# EAGLE design PX4FMUlite_V0_1 (EAGLE 6.5.0)

## Sheet 1 of 12
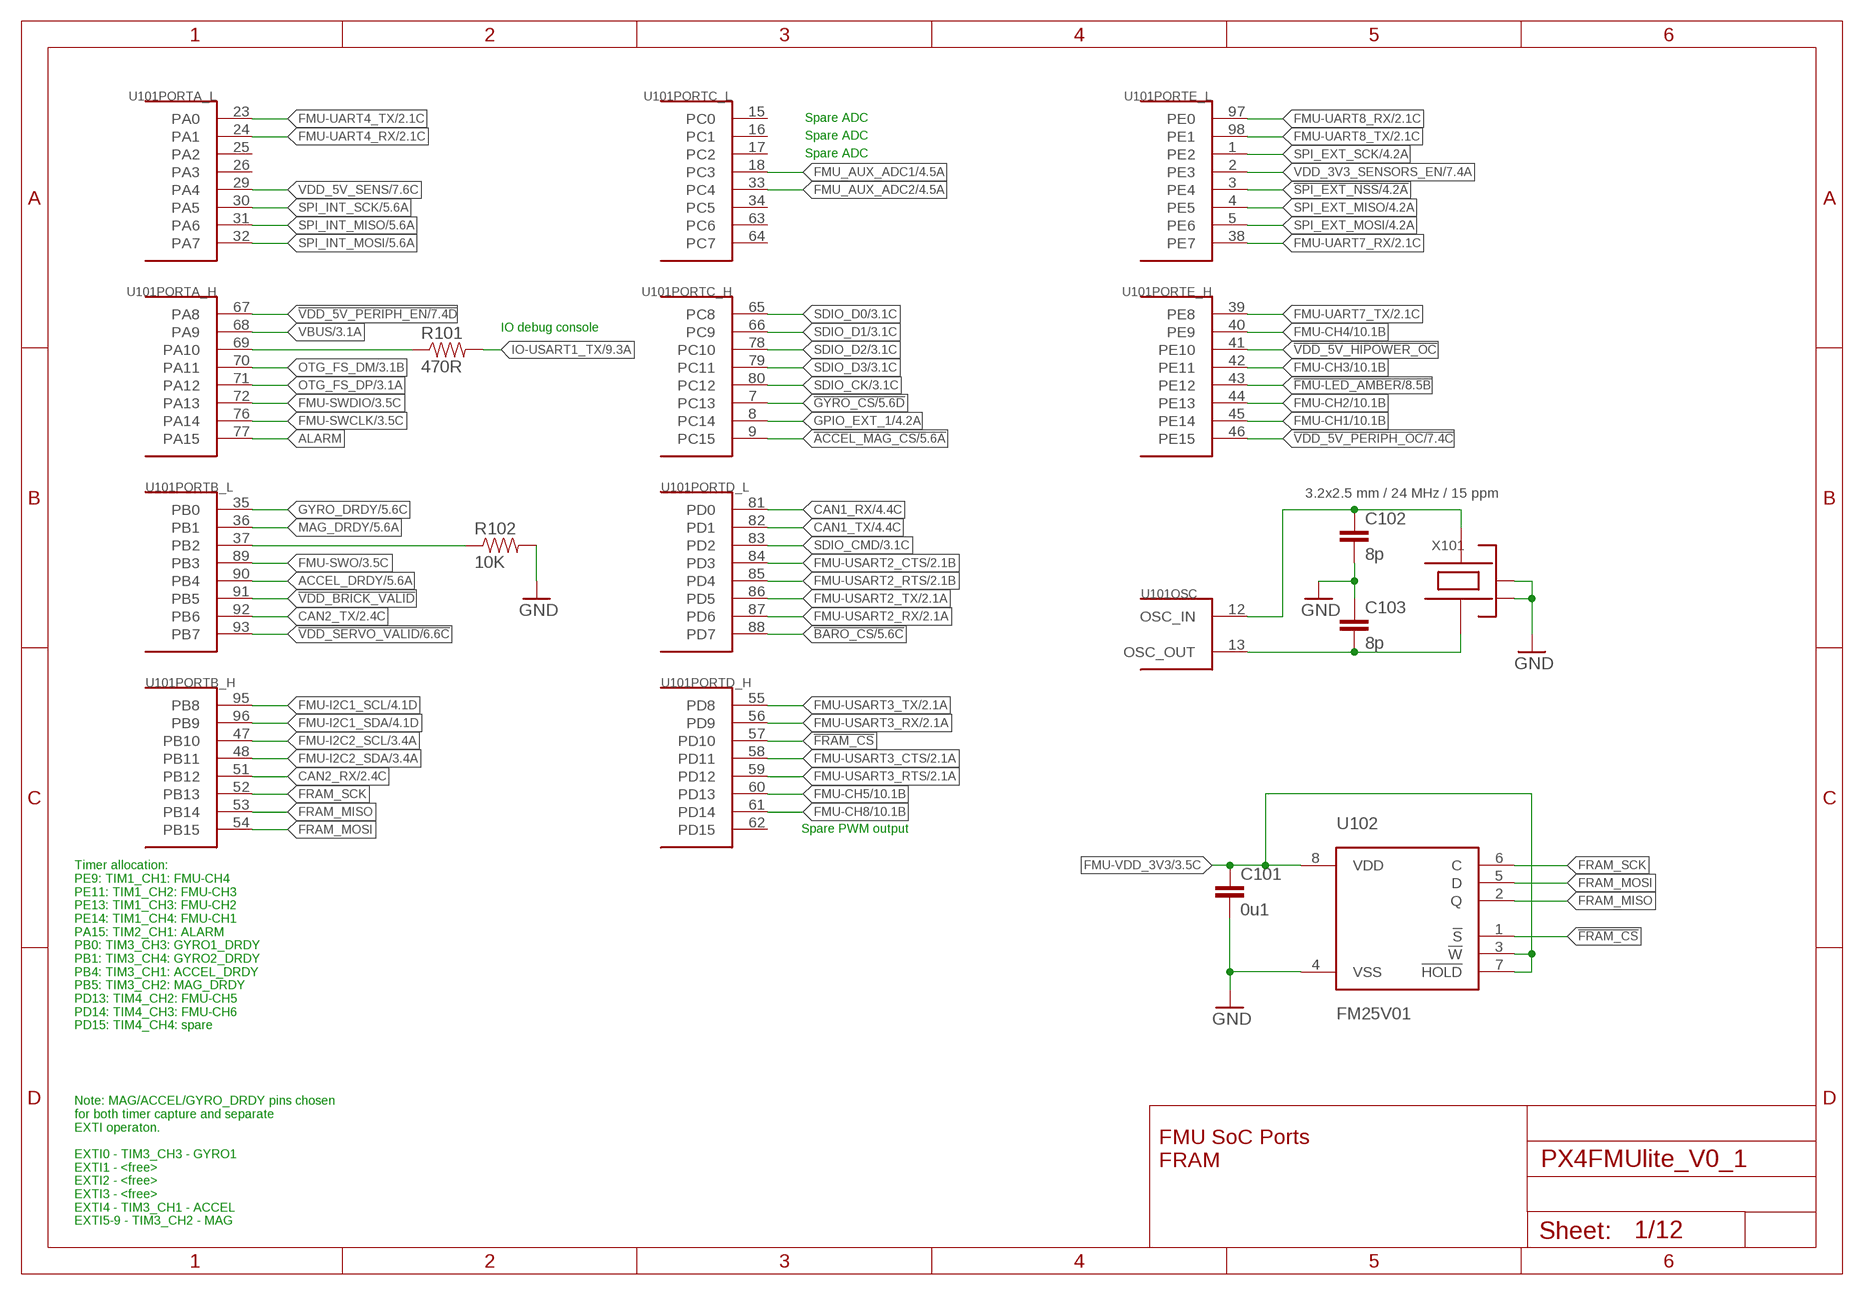
[diagram p0: schematic, sheet 1]

### Parts
C101  0u1  CAP0402  [0402-CAP]
C102  8p  CAP0402  [0402-CAP]
C103  8p  CAP0402  [0402-CAP]
R101  470R  RESISTOR0402-RES  [0402-RES]
R102  10K  RESISTOR0402-RES  [0402-RES]
U101  STM32F4X7VX  [TQFP100]
U102  FM25V01  [SO08]
X101  3.2x2.5 mm / 24 MHz / 15 ppm  OSCILLATOR-3.2X2.5  [OSCILLATOR-3.2X2.5]

### Nets
!ACCEL_MAG_CS: U101.9(PORTC_H:PC15) ; also sheet 5
!BARO_CS: U101.88(PORTD_L:PD7) ; also sheet 5
!FMU-LED_AMBER: U101.43(PORTE_H:PE12) ; also sheet 8
!FRAM_CS: U101.57(PORTD_H:PD10) U102.1(!S)
!GYRO_CS: U101.7(PORTC_H:PC13) ; also sheet 5
!SPI_EXT_NSS: U101.3(PORTE_L:PE4) ; also sheet 4
!VDD_5V_HIPOWER_OC: U101.41(PORTE_H:PE10)
!VDD_5V_PERIPH_EN: U101.67(PORTA_H:PA8) ; also sheet 7
!VDD_5V_PERIPH_OC: U101.46(PORTE_H:PE15) ; also sheet 7
!VDD_BRICK_VALID: U101.91(PORTB_L:PB5)
!VDD_SERVO_VALID: U101.93(PORTB_L:PB7) ; also sheet 6
ACCEL_DRDY: U101.90(PORTB_L:PB4) ; also sheet 5
ALARM: U101.77(PORTA_H:PA15)
CAN1_RX: U101.81(PORTD_L:PD0) ; also sheet 4
CAN1_TX: U101.82(PORTD_L:PD1) ; also sheet 4
CAN2_RX: U101.51(PORTB_H:PB12) ; also sheet 2
CAN2_TX: U101.92(PORTB_L:PB6) ; also sheet 2
FMU-CH1: U101.45(PORTE_H:PE14) ; also sheet 10
FMU-CH2: U101.44(PORTE_H:PE13) ; also sheet 10
FMU-CH3: U101.42(PORTE_H:PE11) ; also sheet 10
FMU-CH4: U101.40(PORTE_H:PE9) ; also sheet 10
FMU-CH5: U101.60(PORTD_H:PD13) ; also sheet 10
FMU-CH8: U101.61(PORTD_H:PD14) ; also sheet 10
FMU-I2C1_SCL: U101.95(PORTB_H:PB8) ; also sheet 4
FMU-I2C1_SDA: U101.96(PORTB_H:PB9) ; also sheet 4
FMU-I2C2_SCL: U101.47(PORTB_H:PB10) ; also sheet 3,8
FMU-I2C2_SDA: U101.48(PORTB_H:PB11) ; also sheet 3,8
FMU-SWCLK: U101.76(PORTA_H:PA14) ; also sheet 3
FMU-SWDIO: U101.72(PORTA_H:PA13) ; also sheet 3
FMU-SWO: U101.89(PORTB_L:PB3) ; also sheet 3
FMU-UART4_RX: U101.24(PORTA_L:PA1) ; also sheet 2
FMU-UART4_TX: U101.23(PORTA_L:PA0) ; also sheet 2
FMU-UART7_RX: U101.38(PORTE_L:PE7) ; also sheet 2
FMU-UART7_TX: U101.39(PORTE_H:PE8) ; also sheet 2
FMU-UART8_RX: U101.97(PORTE_L:PE0) ; also sheet 2
FMU-UART8_TX: U101.98(PORTE_L:PE1) ; also sheet 2
FMU-USART2_CTS: U101.84(PORTD_L:PD3) ; also sheet 2
FMU-USART2_RTS: U101.85(PORTD_L:PD4) ; also sheet 2
FMU-USART2_RX: U101.87(PORTD_L:PD6) ; also sheet 2
FMU-USART2_TX: U101.86(PORTD_L:PD5) ; also sheet 2
FMU-USART3_CTS: U101.58(PORTD_H:PD11) ; also sheet 2
FMU-USART3_RTS: U101.59(PORTD_H:PD12) ; also sheet 2
FMU-USART3_RX: U101.56(PORTD_H:PD9) ; also sheet 2
FMU-USART3_TX: U101.55(PORTD_H:PD8) ; also sheet 2
FMU-VDD_3V3 [power]: C101.P$1 U102.3(!W) U102.7(!HOLD) U102.8(VDD) ; also sheet 3,4,7,8,12
FMU_AUX_ADC1: U101.18(PORTC_L:PC3) ; also sheet 4
FMU_AUX_ADC2: U101.33(PORTC_L:PC4) ; also sheet 4
FRAM_MISO: U101.53(PORTB_H:PB14) U102.2(Q)
FRAM_MOSI: U101.54(PORTB_H:PB15) U102.5(D)
FRAM_SCK: U101.52(PORTB_H:PB13) U102.6(C)
GNDX [power]: C101.P$2 C102.P$2 C103.P$1 R102.P$2 U102.4(VSS) X101.2(NC_2) X101.4(NC_4) ; supply symbol labelled GND ; also sheet 2,3,4,5,6,7,8,9,10,11,12
GPIO_EXT_1: U101.8(PORTC_H:PC14) ; also sheet 4
GYRO_DRDY: U101.35(PORTB_L:PB0) ; also sheet 5
IO-USART1_TX: R101.P$2 ; also sheet 9
MAG_DRDY: U101.36(PORTB_L:PB1) ; also sheet 5
N$1: C103.P$2 U101.13(OSC:OSC_OUT) X101.1
N$2: C102.P$1 U101.12(OSC:OSC_IN) X101.3
N$23: R101.P$1 U101.69(PORTA_H:PA10)
OTG_FS_DM: U101.70(PORTA_H:PA11) ; also sheet 3
OTG_FS_DP: U101.71(PORTA_H:PA12) ; also sheet 3
PB2-BOOT1: R102.P$1 U101.37(PORTB_L:PB2)
SDIO_CK: U101.80(PORTC_H:PC12) ; also sheet 3
SDIO_CMD: U101.83(PORTD_L:PD2) ; also sheet 3
SDIO_D0: U101.65(PORTC_H:PC8) ; also sheet 3
SDIO_D1: U101.66(PORTC_H:PC9) ; also sheet 3
SDIO_D2: U101.78(PORTC_H:PC10) ; also sheet 3
SDIO_D3: U101.79(PORTC_H:PC11) ; also sheet 3
SPI_EXT_MISO: U101.4(PORTE_L:PE5) ; also sheet 4
SPI_EXT_MOSI: U101.5(PORTE_L:PE6) ; also sheet 4
SPI_EXT_SCK: U101.1(PORTE_L:PE2) ; also sheet 4
SPI_INT_MISO: U101.31(PORTA_L:PA6) ; also sheet 5
SPI_INT_MOSI: U101.32(PORTA_L:PA7) ; also sheet 5
SPI_INT_SCK: U101.30(PORTA_L:PA5) ; also sheet 5
VBUS [power]: U101.68(PORTA_H:PA9) ; also sheet 3
VDD_3V3_SENSORS_EN: U101.2(PORTE_L:PE3) ; also sheet 7
VDD_5V_SENS: U101.29(PORTA_L:PA4) ; also sheet 7
Unconnected: U101.15(PORTC_L:PC0) U101.16(PORTC_L:PC1) U101.17(PORTC_L:PC2) U101.25(PORTA_L:PA2) U101.26(PORTA_L:PA3) U101.34(PORTC_L:PC5) U101.62(PORTD_H:PD15) U101.63(PORTC_L:PC6) U101.64(PORTC_L:PC7)

### Notes on the sheet
- Spare ADC
- Spare ADC
- Spare ADC
- IO debug console
- Spare PWM output
- Timer allocation:
  PE9: TIM1_CH1: FMU-CH4
  PE11: TIM1_CH2: FMU-CH3
  PE13: TIM1_CH3: FMU-CH2
  PE14: TIM1_CH4: FMU-CH1
  PA15: TIM2_CH1: ALARM
  PB0: TIM3_CH3: GYRO1_DRDY
  PB1: TIM3_CH4: GYRO2_DRDY
  PB4: TIM3_CH1: ACCEL_DRDY
  PB5: TIM3_CH2: MAG_DRDY
  PD13: TIM4_CH2: FMU-CH5
  PD14: TIM4_CH3: FMU-CH6
  PD15: TIM4_CH4: spare
- FMU SoC Ports
  FRAM
- Note: MAG/ACCEL/GYRO_DRDY pins chosen
  for both timer capture and separate
  EXTI operaton.
  
  EXTI0 - TIM3_CH3 - GYRO1
  EXTI1 - <free>
  EXTI2 - <free>
  EXTI3 - <free>
  EXTI4 - TIM3_CH1 - ACCEL
  EXTI5-9 - TIM3_CH2 - MAG

## Sheet 2 of 12
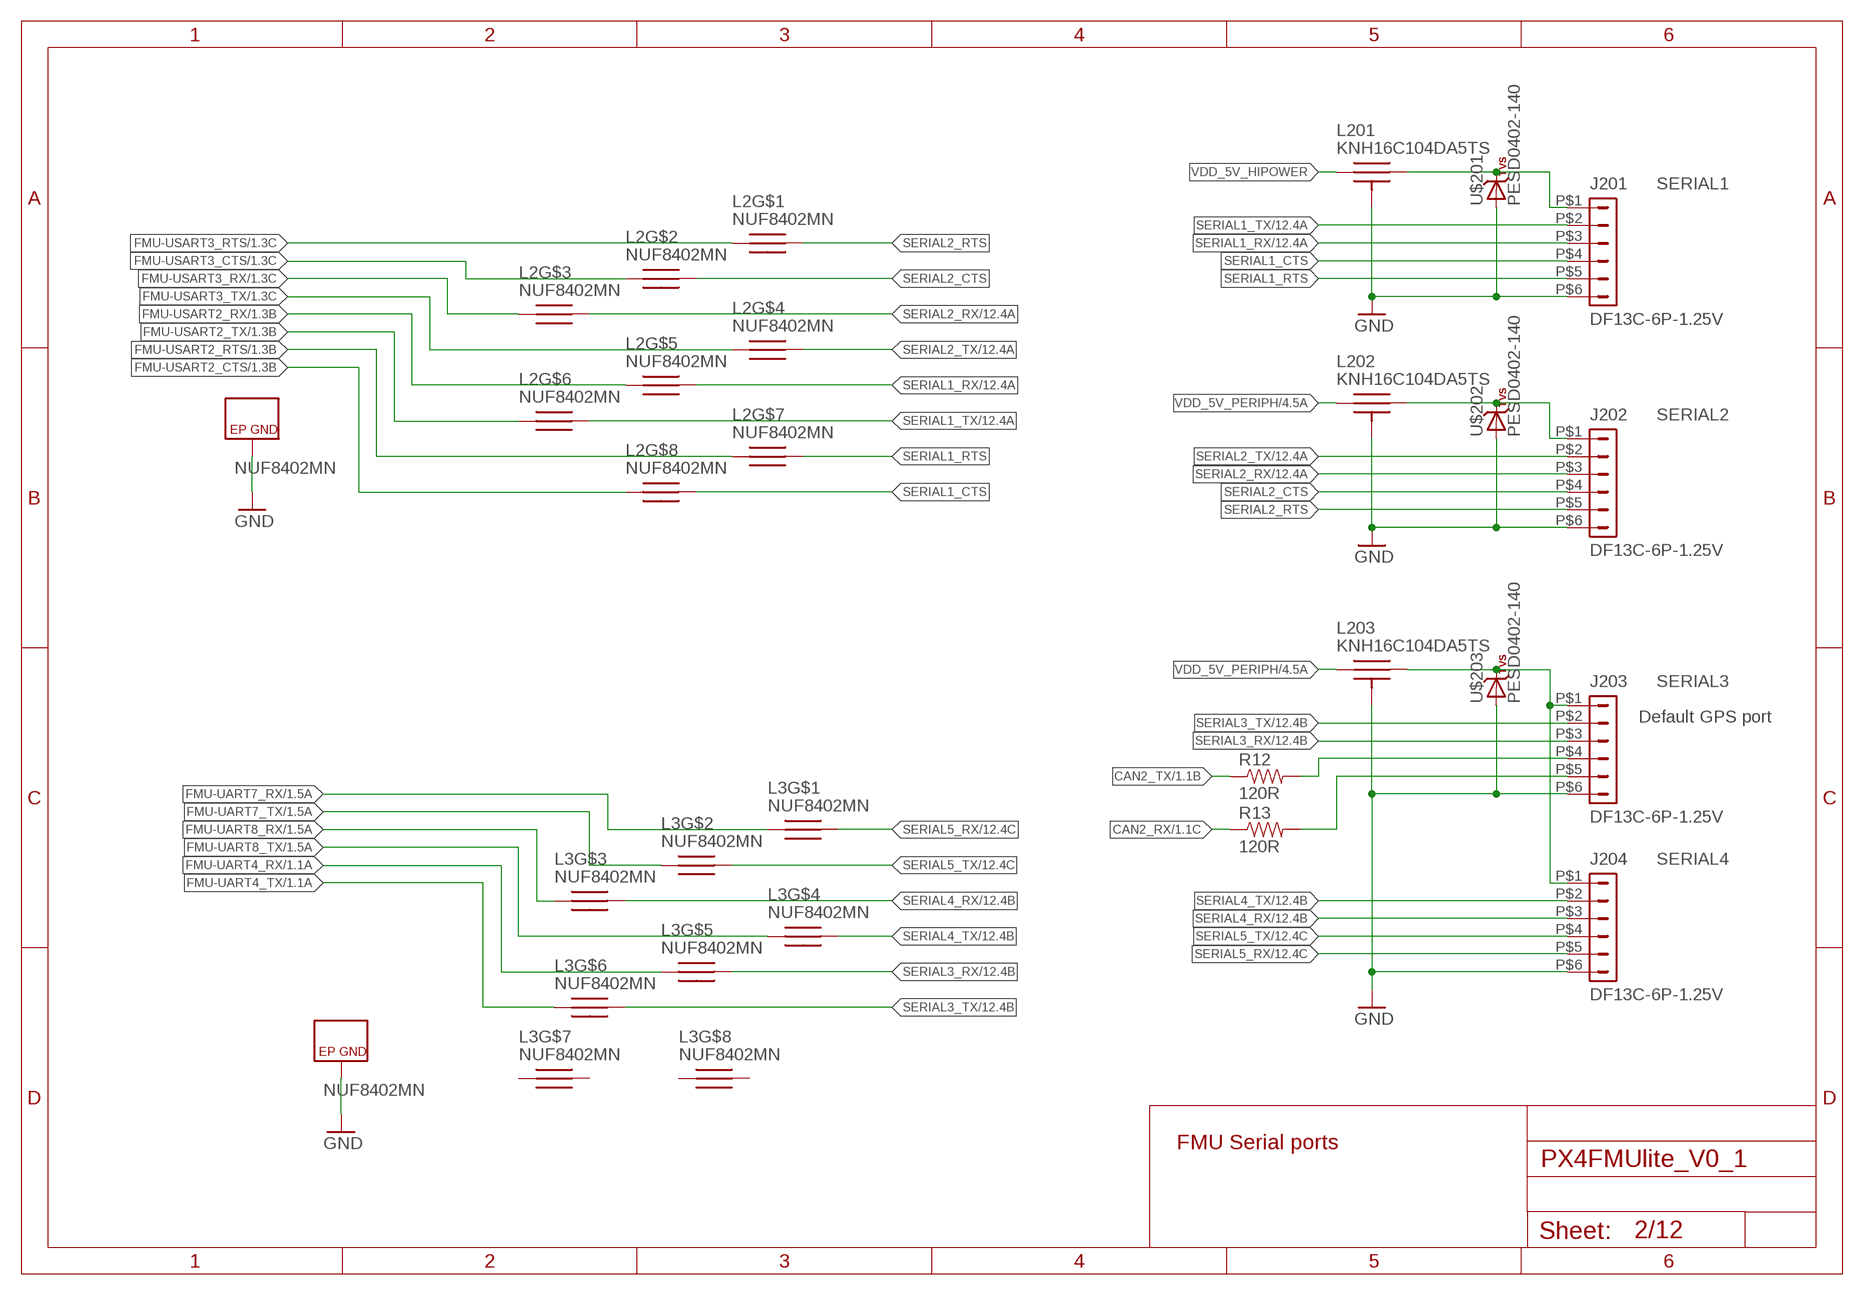
[diagram p1: schematic, sheet 2]

### Parts
J201  DF13C-6P-1.25V  DF13-6P-1.25V  [DF13C-6P-1.25V]
J202  DF13C-6P-1.25V  DF13-6P-1.25V  [DF13C-6P-1.25V]
J203  DF13C-6P-1.25V  DF13-6P-1.25V  [DF13C-6P-1.25V]
J204  DF13C-6P-1.25V  DF13-6P-1.25V  [DF13C-6P-1.25V]
L2  NUF8402MN  [DFN16-THIN]
L3  NUF8402MN  [DFN16-THIN]
L201  KNH16C104DA5TS  [KYOCERA-KNH16-DA]
L202  KNH16C104DA5TS  [KYOCERA-KNH16-DA]
L203  KNH16C104DA5TS  [KYOCERA-KNH16-DA]
R12  120R  RESISTOR0402-RES  [0402-RES]
R13  120R  RESISTOR0402-RES  [0402-RES]
U$201  PESD0402-140  DIODE-TVS  [0402-TVS]
U$202  PESD0402-140  DIODE-TVS  [0402-TVS]
U$203  PESD0402-140  DIODE-TVS  [0402-TVS]

### Nets
CAN2_RX: R13.P$1 ; also sheet 1
CAN2_TX: R12.P$1 ; also sheet 1
FMU-UART4_RX: L3.P$5 ; also sheet 1
FMU-UART4_TX: L3.P$6 ; also sheet 1
FMU-UART7_RX: L3.P$1 ; also sheet 1
FMU-UART7_TX: L3.P$2 ; also sheet 1
FMU-UART8_RX: L3.P$3 ; also sheet 1
FMU-UART8_TX: L3.P$4 ; also sheet 1
FMU-USART2_CTS: L2.P$8 ; also sheet 1
FMU-USART2_RTS: L2.P$7 ; also sheet 1
FMU-USART2_RX: L2.P$5 ; also sheet 1
FMU-USART2_TX: L2.P$6 ; also sheet 1
FMU-USART3_CTS: L2.P$2 ; also sheet 1
FMU-USART3_RTS: L2.P$1 ; also sheet 1
FMU-USART3_RX: L2.P$3 ; also sheet 1
FMU-USART3_TX: L2.P$4 ; also sheet 1
GNDX [power]: J201.P$6 J202.P$6 J203.P$6 J204.P$6 L201.P$3 L201.P$4 L201.P$5 L202.P$3 L202.P$4 L202.P$5 L203.P$3 L203.P$4 L203.P$5 U$201.A U$202.A U$203.A ; supply symbol labelled GND ; also sheet 1,3,4,5,6,7,8,9,10,11,12
N$5 [power]: J201.P$1 L201.P$2 U$201.C
N$14: J203.P$4 R12.P$2
N$19: J203.P$5 R13.P$2
N$100 [power]: J203.P$1 J204.P$1 L203.P$2 U$203.C
N$101 [power]: J202.P$1 L202.P$2 U$202.C
SERIAL1_CTS: J201.P$4 L2.P$9
SERIAL1_RTS: J201.P$5 L2.P$10
SERIAL1_RX: J201.P$3 L2.P$12 ; also sheet 12
SERIAL1_TX: J201.P$2 L2.P$11 ; also sheet 12
SERIAL2_CTS: J202.P$4 L2.P$15
SERIAL2_RTS: J202.P$5 L2.P$16
SERIAL2_RX: J202.P$3 L2.P$14 ; also sheet 12
SERIAL2_TX: J202.P$2 L2.P$13 ; also sheet 12
SERIAL3_RX: J203.P$3 L3.P$12 ; also sheet 12
SERIAL3_TX: J203.P$2 L3.P$11 ; also sheet 12
SERIAL4_RX: J204.P$3 L3.P$14 ; also sheet 12
SERIAL4_TX: J204.P$2 L3.P$13 ; also sheet 12
SERIAL5_RX: J204.P$5 L3.P$16 ; also sheet 12
SERIAL5_TX: J204.P$4 L3.P$15 ; also sheet 12
VDD_5V_HIPOWER [power]: L201.P$1
VDD_5V_PERIPH [power]: L202.P$1 L203.P$1 ; also sheet 4,7
Unconnected: L3.P$7 L3.P$8 L3.P$9 L3.P$10

### Notes on the sheet
- SERIAL1
- SERIAL2
- SERIAL3
- Default GPS port
- SERIAL4
- FMU Serial ports

## Sheet 3 of 12
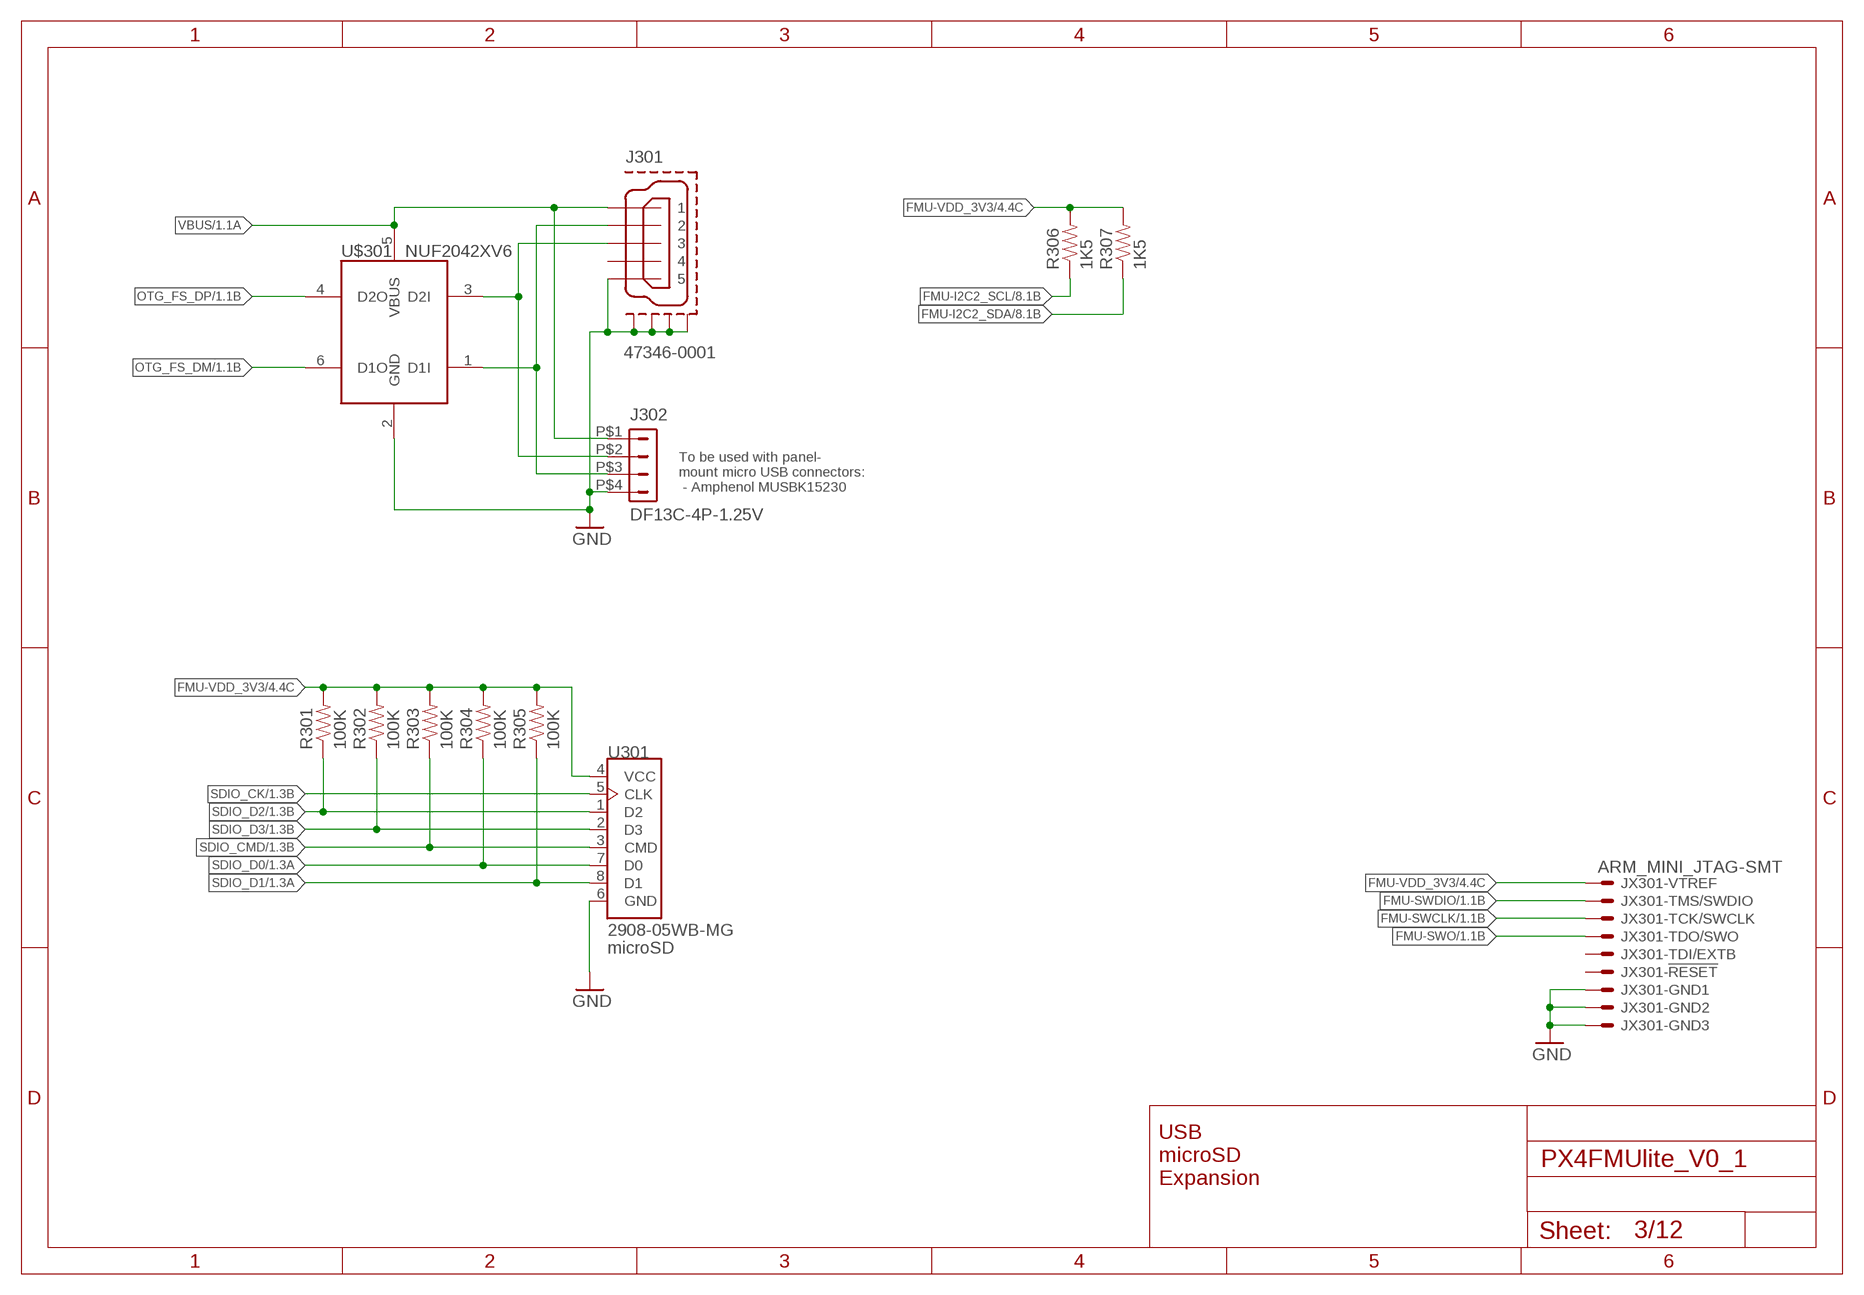
[diagram p2: schematic, sheet 3]

### Parts
J301  47346-0001  MOLEX-47346-0001  [MOLEX-47346-0001]
J302  DF13C-4P-1.25V  DF13-4P-1.25V  [DF13C-4P-1.25V]
JX301  ARM_MINI_JTAG-SMT  [FTSH-105-01-XXX-DV-K]
R301  100K  RESISTOR0402-RES  [0402-RES]
R302  100K  RESISTOR0402-RES  [0402-RES]
R303  100K  RESISTOR0402-RES  [0402-RES]
R304  100K  RESISTOR0402-RES  [0402-RES]
R305  100K  RESISTOR0402-RES  [0402-RES]
R306  1K5  RESISTOR0402-RES  [0402-RES]
R307  1K5  RESISTOR0402-RES  [0402-RES]
U301  2908-05WB-MG  MICROSDSDI  [MICROSD]
U$301  NUF2042XV6  [SOT563-6]

### Nets
FMU-I2C2_SCL: R306.P$1 ; also sheet 1,8
FMU-I2C2_SDA: R307.P$1 ; also sheet 1,8
FMU-SWCLK: JX301.4 ; also sheet 1
FMU-SWDIO: JX301.2 ; also sheet 1
FMU-SWO: JX301.6 ; also sheet 1
FMU-VDD_3V3 [power]: JX301.1 R301.P$2 R302.P$2 R303.P$2 R304.P$2 R305.P$2 R306.P$2 R307.P$2 U301.4(VCC) ; also sheet 1,4,7,8,12
GNDX [power]: J301.GND J301.GND1 J301.GND2 J301.GND3 J301.GND4 J302.P$4 JX301.3 JX301.5 JX301.9 U301.6(GND) U$301.2(GND) ; supply symbol labelled GND ; also sheet 1,2,4,5,6,7,8,9,10,11,12
OTG_DM1: J301.D- J302.P$3 U$301.1(D1I)
OTG_DP1: J301.D+ J302.P$2 U$301.3(D2I)
OTG_FS_DM: U$301.6(D1O) ; also sheet 1
OTG_FS_DP: U$301.4(D2O) ; also sheet 1
SDIO_CK: U301.5(CLK) ; also sheet 1
SDIO_CMD: R303.P$1 U301.3(CMD) ; also sheet 1
SDIO_D0: R304.P$1 U301.7(D0) ; also sheet 1
SDIO_D1: R305.P$1 U301.8(D1) ; also sheet 1
SDIO_D2: R301.P$1 U301.1(D2) ; also sheet 1
SDIO_D3: R302.P$1 U301.2(D3) ; also sheet 1
VBUS [power]: J301.VBUS J302.P$1 U$301.5(VBUS) ; also sheet 1
Unconnected: J301.ID JX301.8 JX301.10

### Notes on the sheet
- To be used with panel-
  mount micro USB connectors:
   - Amphenol MUSBK15230
- microSD
- USB
  microSD
  Expansion

## Sheet 4 of 12
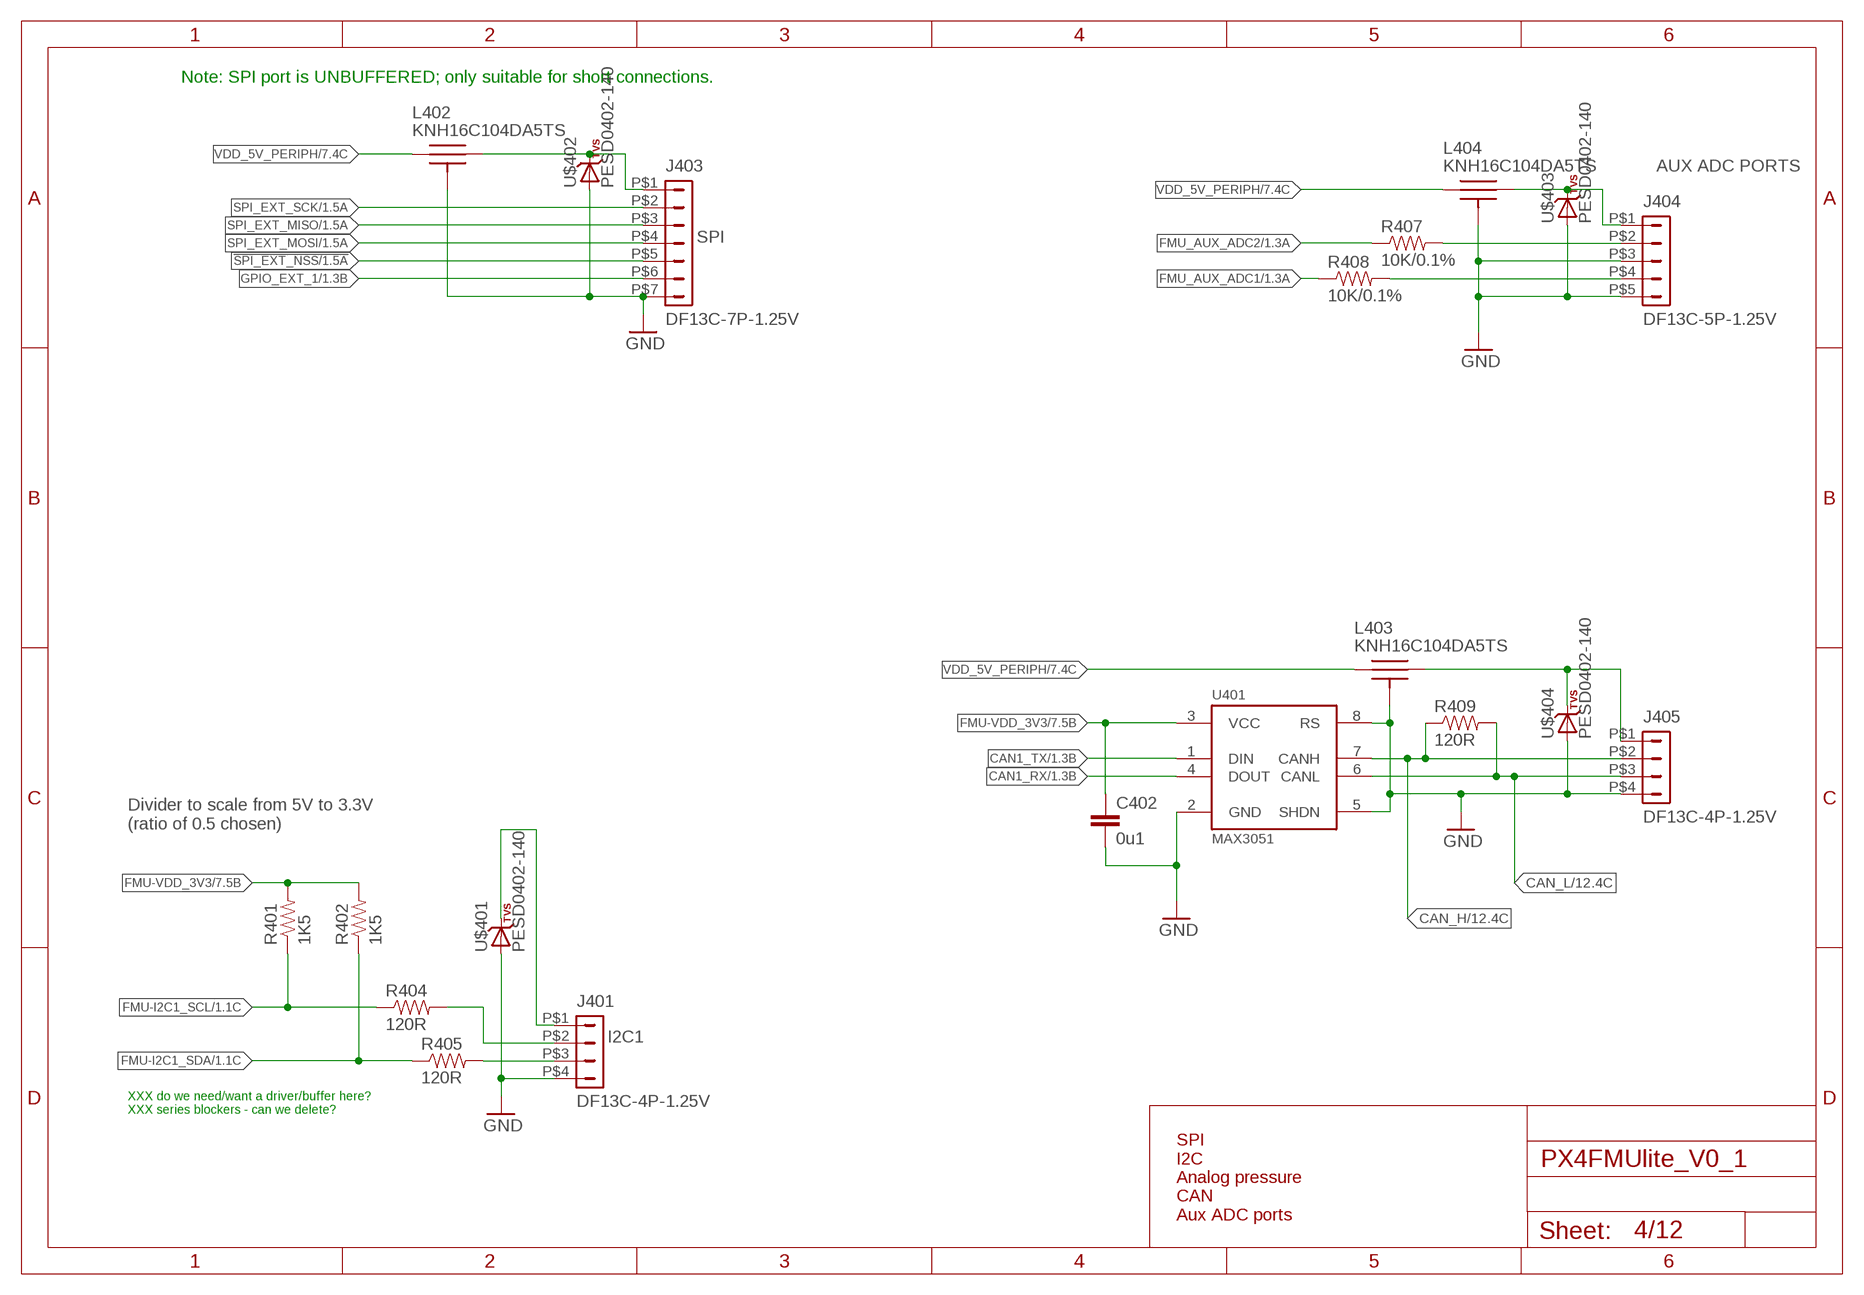
[diagram p3: schematic, sheet 4]

### Parts
C402  0u1  CAP0402  [0402-CAP]
J401  DF13C-4P-1.25V  DF13-4P-1.25V  [DF13C-4P-1.25V]
J403  DF13C-7P-1.25V  DF13-7P-1.25V  [DF13C-7P-1.25V]
J404  DF13C-5P-1.25V  DF13-5P-1.25V  [DF13C-5P-1.25V]
J405  DF13C-4P-1.25V  DF13-4P-1.25V  [DF13C-4P-1.25V]
L402  KNH16C104DA5TS  [KYOCERA-KNH16-DA]
L403  KNH16C104DA5TS  [KYOCERA-KNH16-DA]
L404  KNH16C104DA5TS  [KYOCERA-KNH16-DA]
R401  1K5  RESISTOR0402-RES  [0402-RES]
R402  1K5  RESISTOR0402-RES  [0402-RES]
R404  120R  RESISTOR0402-RES  [0402-RES]
R405  120R  RESISTOR0402-RES  [0402-RES]
R407  10K/0.1%  RESISTOR0402-RES  [0402-RES]
R408  10K/0.1%  RESISTOR0402-RES  [0402-RES]
R409  120R  RESISTOR0402-RES  [0402-RES]
U401  MAX3051  MAX3051MAX3051EKA  [SOT23-8]
U$401  PESD0402-140  DIODE-TVS  [0402-TVS]
U$402  PESD0402-140  DIODE-TVS  [0402-TVS]
U$403  PESD0402-140  DIODE-TVS  [0402-TVS]
U$404  PESD0402-140  DIODE-TVS  [0402-TVS]

### Nets
!SPI_EXT_NSS: J403.P$5 ; also sheet 1
CAN1_RX: U401.4(DOUT) ; also sheet 1
CAN1_TX: U401.1(DIN) ; also sheet 1
CAN_H: J405.P$2 R409.P$1 U401.7(CANH) ; also sheet 12
CAN_L: J405.P$3 R409.P$2 U401.6(CANL) ; also sheet 12
FMU-I2C1_SCL: R401.P$1 R404.P$1 ; also sheet 1
FMU-I2C1_SDA: R402.P$1 R405.P$1 ; also sheet 1
FMU-VDD_3V3 [power]: C402.P$1 R401.P$2 R402.P$2 U401.3(VCC) ; also sheet 1,3,7,8,12
FMU_AUX_ADC1: R408.P$1 ; also sheet 1
FMU_AUX_ADC1_PROT: J404.P$4 R408.P$2
FMU_AUX_ADC2: R407.P$1 ; also sheet 1
FMU_AUX_ADC2_PROT: J404.P$2 R407.P$2
GNDX [power]: C402.P$2 J401.P$4 J403.P$7 J404.P$3 J404.P$5 J405.P$4 L402.P$3 L402.P$4 L402.P$5 L403.P$3 L403.P$4 L403.P$5 L404.P$3 L404.P$4 L404.P$5 U401.2(GND) U401.5(SHDN) U401.8(RS) U$401.A U$402.A U$403.A U$404.A ; supply symbol labelled GND ; also sheet 1,2,3,5,6,7,8,9,10,11,12
GPIO_EXT_1: J403.P$6 ; also sheet 1
N$33: J401.P$2 R404.P$2
N$37: J401.P$3 R405.P$2
N$41 [power]: J403.P$1 L402.P$2 U$402.C
N$42 [power]: J401.P$1 U$401.C
N$48 [power]: J405.P$1 L403.P$2 U$404.C
N$98 [power]: J404.P$1 L404.P$2 U$403.C
SPI_EXT_MISO: J403.P$3 ; also sheet 1
SPI_EXT_MOSI: J403.P$4 ; also sheet 1
SPI_EXT_SCK: J403.P$2 ; also sheet 1
VDD_5V_PERIPH [power]: L402.P$1 L403.P$1 L404.P$1 ; also sheet 2,7

### Notes on the sheet
- Note: SPI port is UNBUFFERED; only suitable for short connections.
- AUX ADC PORTS
- SPI
- Divider to scale from 5V to 3.3V
  (ratio of 0.5 chosen)
- I2C1
- XXX do we need/want a driver/buffer here?
  XXX series blockers - can we delete?
- SPI
  I2C
  Analog pressure
  CAN
  Aux ADC ports

## Sheet 5 of 12
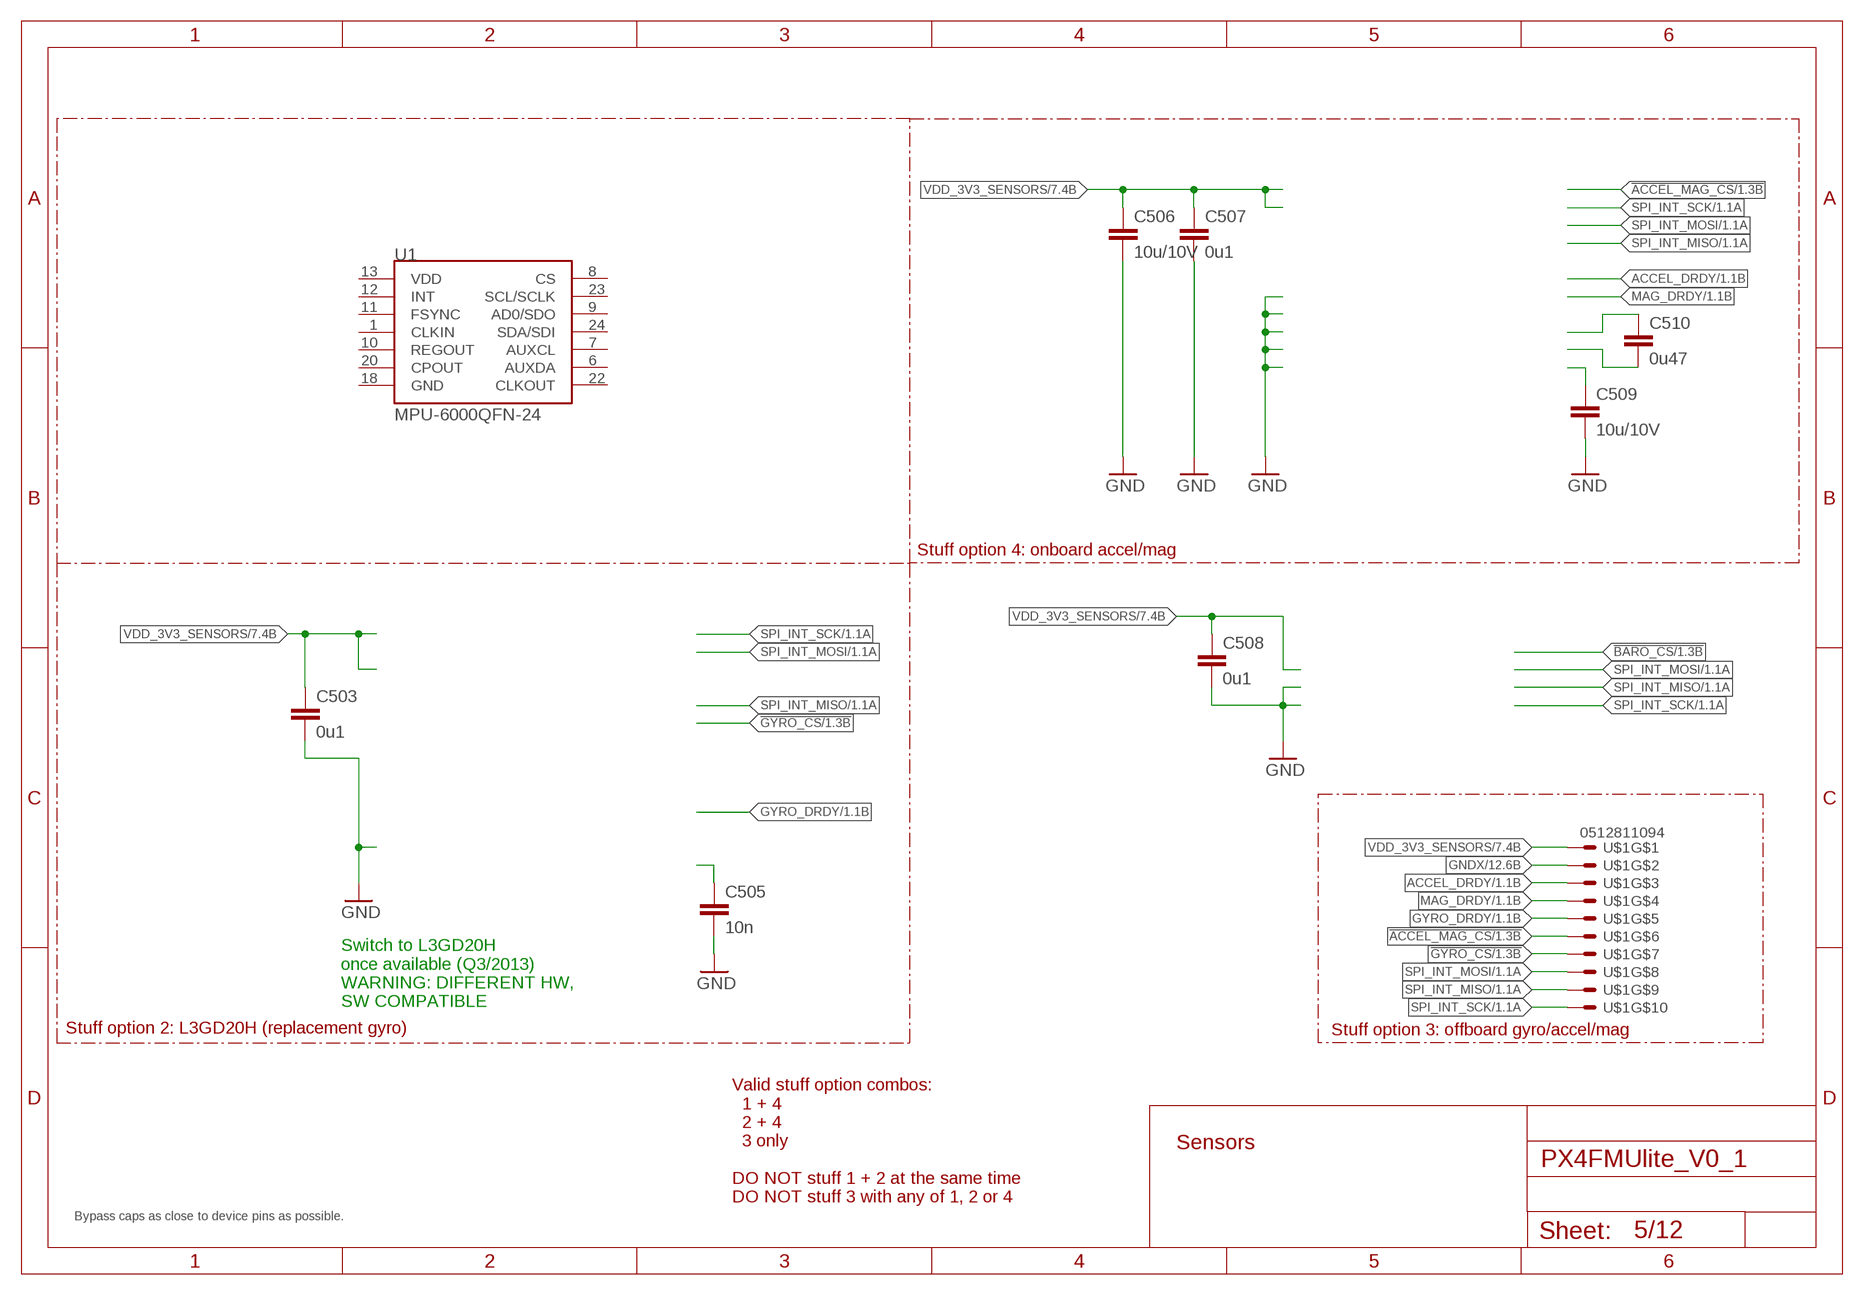
[diagram p4: schematic, sheet 5]

### Parts
C503  0u1  CAP0402  [0402-CAP]
C505  10n  CAP0402  [0402-CAP]
C506  10u/10V  CAP0805  [0805-CAP]
C507  0u1  CAP0402  [0402-CAP]
C508  0u1  CAP0402  [0402-CAP]
C509  10u/10V  CAP0805  [0805-CAP]
C510  0u47  CAP0402  [0402-CAP]
U1  MPU-6000QFN-24  [QFN-24-TESTING]
U$1  0512811094  CONN_FPC_10RA  [51281-1094]

### Nets
!ACCEL_MAG_CS: U$1.6 ; also sheet 1
!GYRO_CS: U$1.7 ; also sheet 1
ACCEL_DRDY: U$1.3 ; also sheet 1
GNDX [power]: C503.P$2 C505.P$2 C506.P$2 C507.P$2 C508.P$2 C509.P$2 U$1.2 ; supply symbol labelled GND ; also sheet 1,2,3,4,6,7,8,9,10,11,12
GYRO_DRDY: U$1.5 ; also sheet 1
MAG_DRDY: U$1.4 ; also sheet 1
N$6: C509.P$1
N$10: C510.P$1
N$17: C510.P$2
N$30: C505.P$1
SPI_INT_MISO: U$1.9 ; also sheet 1
SPI_INT_MOSI: U$1.8 ; also sheet 1
SPI_INT_SCK: U$1.10 ; also sheet 1
VDD_3V3_SENSORS [power]: C503.P$1 C506.P$1 C507.P$1 C508.P$1 U$1.1 ; also sheet 7,12
Unconnected: U1.1(CLKIN) U1.6(AUXDA) U1.7(AUXCL) U1.8(CS) U1.9(AD0/SDO) U1.10(REGOUT) U1.11(FSYNC) U1.12(INT) U1.13(VDD) U1.18(GND) U1.20(CPOUT) U1.22(CLKOUT) U1.23(SCL/SCLK) U1.24(SDA/SDI)

### Notes on the sheet
- Stuff option 4: onboard accel/mag
- Switch to L3GD20H
  once available (Q3/2013)
  WARNING: DIFFERENT HW,
  SW COMPATIBLE
- Stuff option 2: L3GD20H (replacement gyro) | Stuff option 3: offboard gyro/accel/mag
- Sensors
- Valid stuff option combos:
    1 + 4
    2 + 4
    3 only
  
  DO NOT stuff 1 + 2 at the same time
  DO NOT stuff 3 with any of 1, 2 or 4
- Bypass caps as close to device pins as possible.

## Sheet 6 of 12
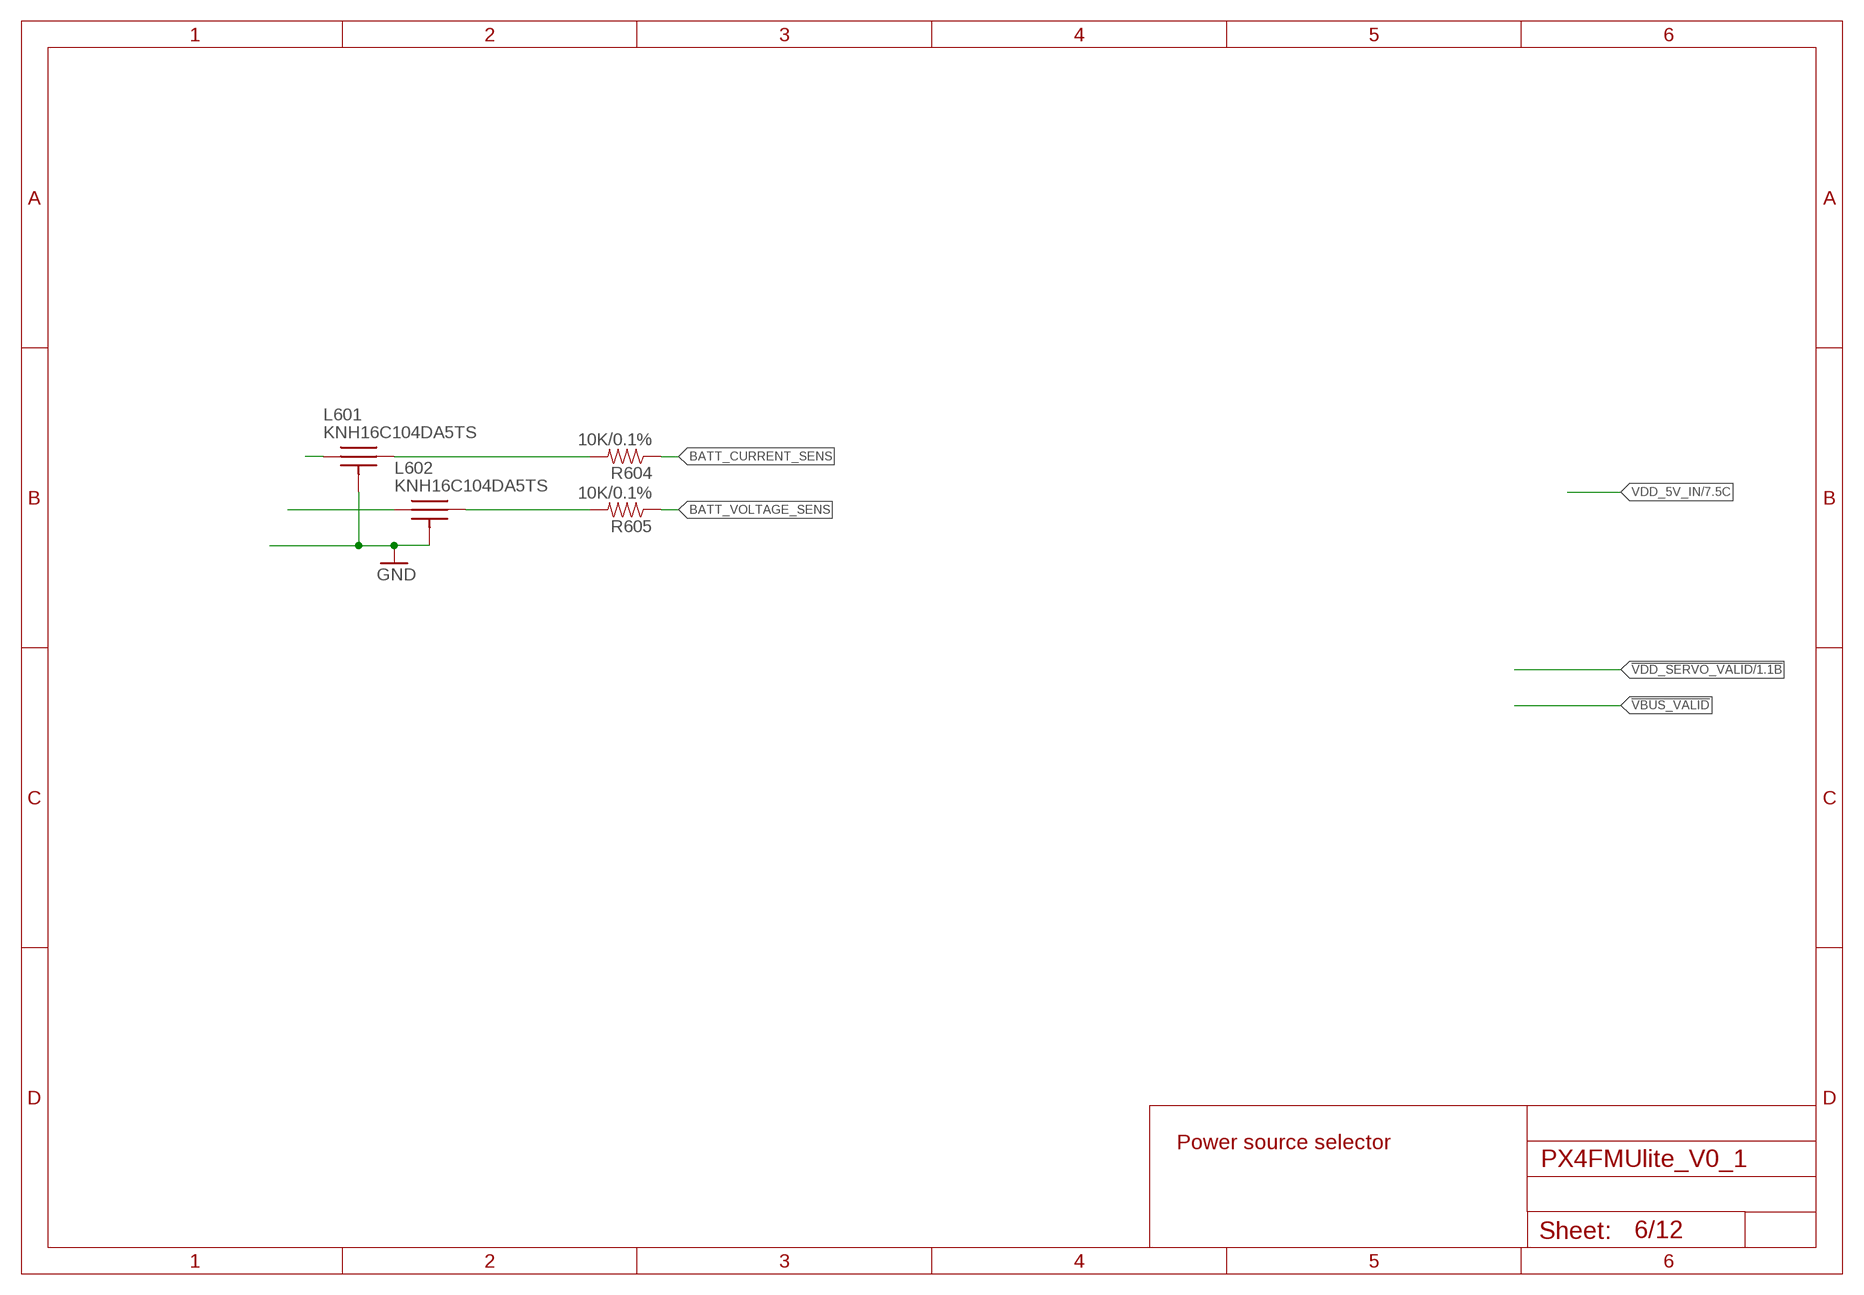
[diagram p5: schematic, sheet 6]

### Parts
L601  KNH16C104DA5TS  [KYOCERA-KNH16-DA]
L602  KNH16C104DA5TS  [KYOCERA-KNH16-DA]
R604  10K/0.1%  RESISTOR0402-RES  [0402-RES]
R605  10K/0.1%  RESISTOR0402-RES  [0402-RES]

### Nets
BATT_CURRENT_SENS: R604.P$1
BATT_VOLTAGE_SENS: R605.P$1
BATT_VOLTAGE_SENS_PROT: L602.P$1
GNDX [power]: L601.P$3 L601.P$4 L601.P$5 L602.P$3 L602.P$4 L602.P$5 ; supply symbol labelled GND ; also sheet 1,2,3,4,5,7,8,9,10,11,12
N$21: L601.P$1
N$102: L602.P$2 R605.P$2
N$103: L601.P$2 R604.P$2

### Notes on the sheet
- Power source selector

## Sheet 7 of 12
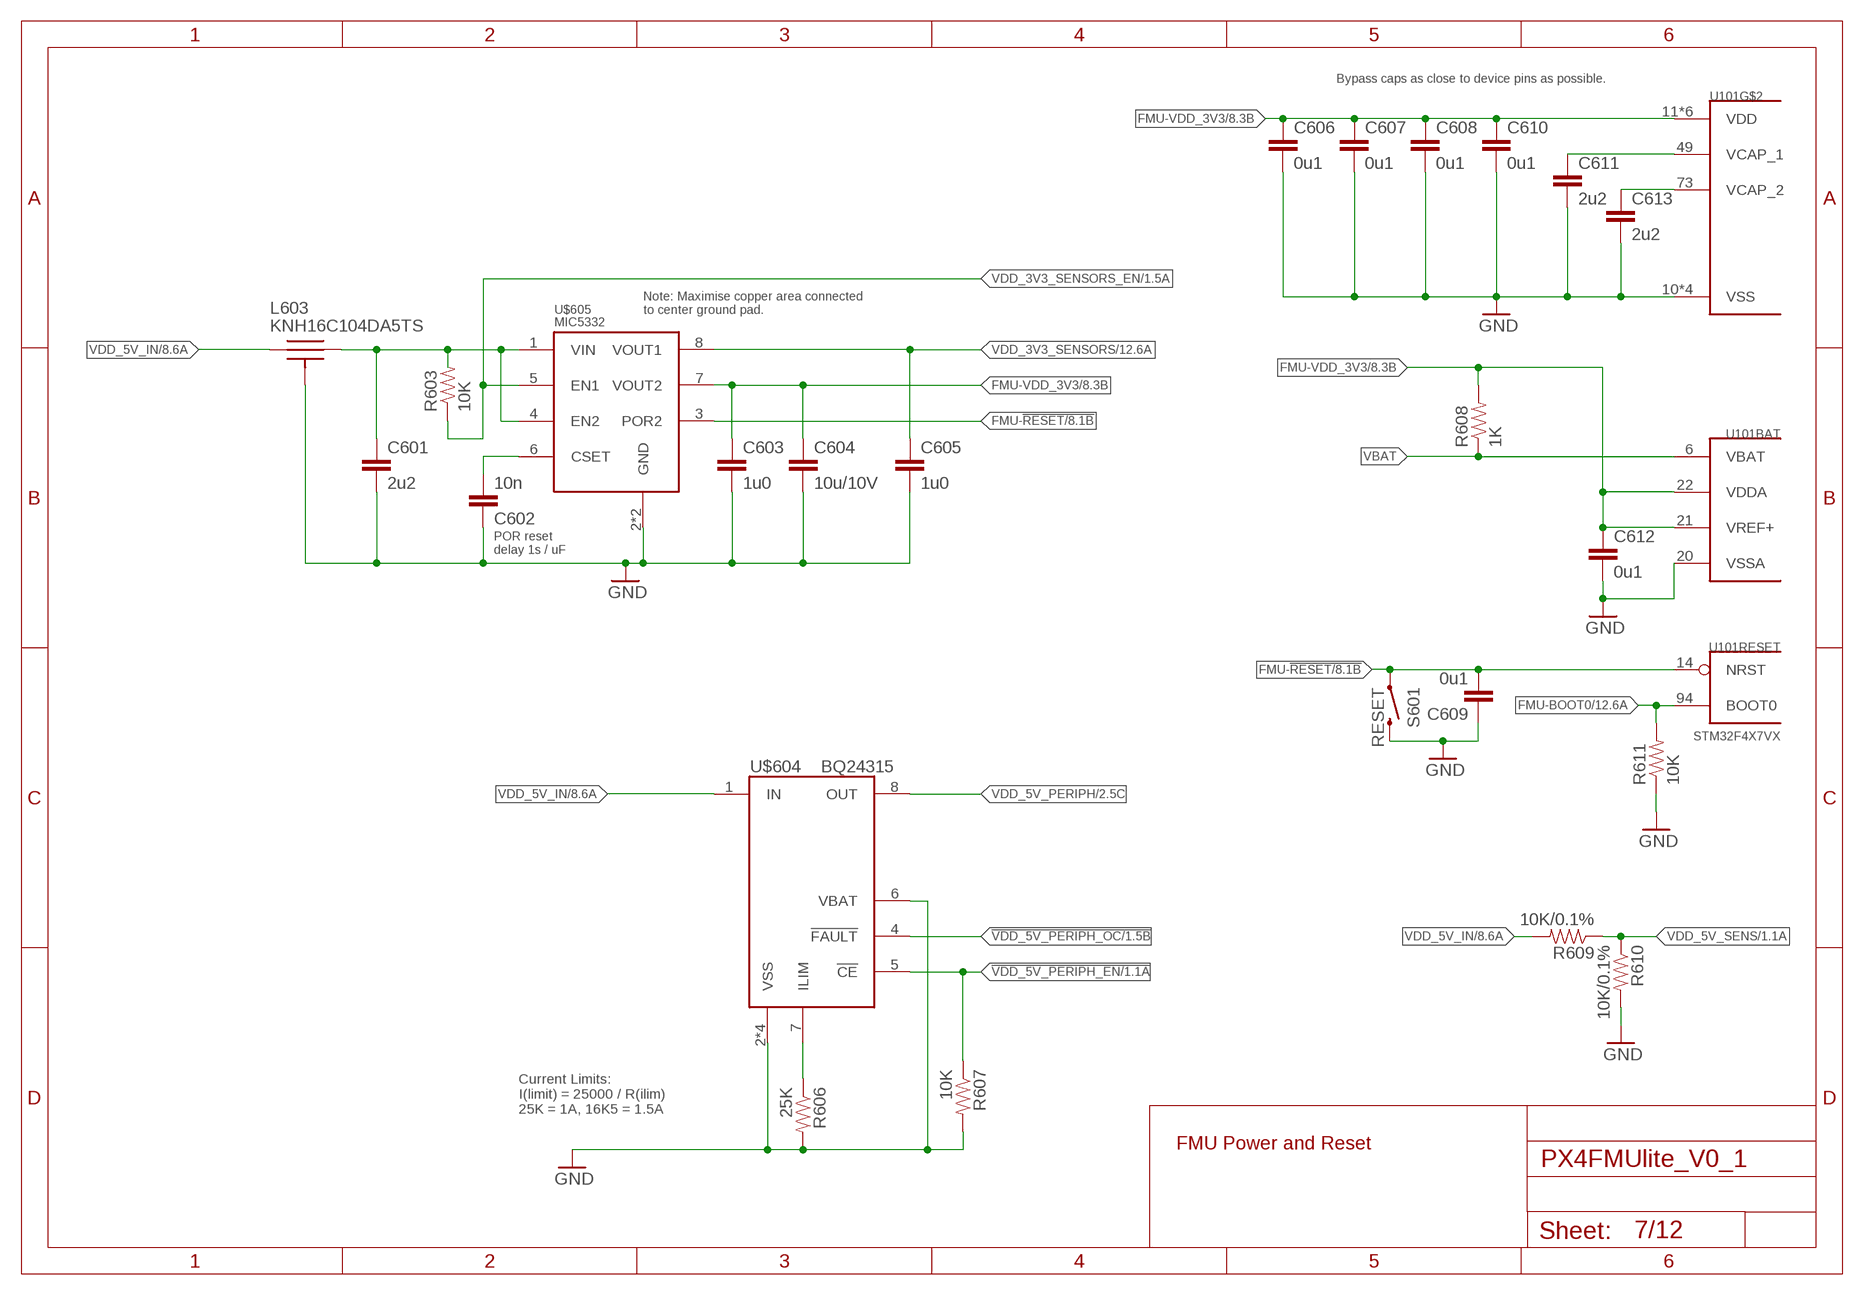
[diagram p6: schematic, sheet 7]

### Parts
C601  2u2  CAP0603  [0603-CAP]
C602  10n  CAP0402  [0402-CAP]
C603  1u0  CAP0603  [0603-CAP]
C604  10u/10V  CAP0805  [0805-CAP]
C605  1u0  CAP0603  [0603-CAP]
C606  0u1  CAP0402  [0402-CAP]
C607  0u1  CAP0402  [0402-CAP]
C608  0u1  CAP0402  [0402-CAP]
C609  0u1  CAP0402  [0402-CAP]
C610  0u1  CAP0402  [0402-CAP]
C611  2u2  CAP0603  [0603-CAP]
C612  0u1  CAP0402  [0402-CAP]
C613  2u2  CAP0603  [0603-CAP]
L603  KNH16C104DA5TS  [KYOCERA-KNH16-DA]
R603  10K  RESISTOR0402-RES  [0402-RES]
R606  25K  RESISTOR0402-RES  [0402-RES]
R607  10K  RESISTOR0402-RES  [0402-RES]
R608  1K  RESISTOR0402-RES  [0402-RES]
R609  10K/0.1%  RESISTOR0402-RES  [0402-RES]
R610  10K/0.1%  RESISTOR0402-RES  [0402-RES]
R611  10K  RESISTOR0402-RES  [0402-RES]
S601  RESET  SWITCH-MOMENTARY-2  [EVQP7J01K]
U$604  BQ24315  [QFN8-DSG]
U$605  MIC5332  [MLF-8-EPAD]

### Nets
!VDD_5V_PERIPH_EN: R607.P$1 U$604.5(!CE) ; also sheet 1
!VDD_5V_PERIPH_OC: U$604.4(!FAULT) ; also sheet 1
FMU-!RESET: C609.P$2 S601.A1 U101.14(RESET:NRST) U$605.3(POR2) ; also sheet 8
FMU-BOOT0: R611.P$2 U101.94(RESET:BOOT0) ; also sheet 12
FMU-VDD_3V3 [power]: C603.P$1 C604.P$1 C606.P$1 C607.P$1 C608.P$1 C610.P$1 C612.P$1 R608.P$2 U101.11(VDD) U101.19(VDD) U101.21(BAT:VREF+) U101.22(BAT:VDDA) U101.28(VDD) U101.50(VDD) U101.75(VDD) U101.100(VDD) U$605.7(VOUT2) ; also sheet 1,3,4,8,12
FMU-VDD_5V5 [power]: C601.P$1 L603.P$2 R603.P$2 U$605.1(VIN) U$605.4(EN2)
GNDX [power]: C601.P$2 C602.P$1 C603.P$2 C604.P$2 C605.P$2 C606.P$2 C607.P$2 C608.P$2 C609.P$1 C610.P$2 C611.P$2 C612.P$2 C613.P$2 L603.P$3 L603.P$4 L603.P$5 R606.P$2 R607.P$2 R610.P$2 R611.P$1 S601.B3 U101.10(VSS) U101.20(BAT:VSSA) U101.27(VSS) U101.74(VSS) U101.99(VSS) U$604.2(VSS) U$604.6(VBAT) U$604.GND(VSS) U$604.P$2(VSS) U$604.P$3(VSS) U$605.2(GND) U$605.GND ; supply symbol labelled GND ; also sheet 1,2,3,4,5,6,8,9,10,11,12
N$8: C613.P$1 U101.73(VCAP_2)
N$11: C602.P$2 U$605.6(CSET)
N$12: C611.P$1 U101.49(VCAP_1)
N$34: R606.P$1 U$604.7(ILIM)
VBAT: R608.P$1 U101.6(BAT:VBAT)
VDD_3V3_SENSORS [power]: C605.P$1 U$605.8(VOUT1) ; also sheet 5,12
VDD_3V3_SENSORS_EN: R603.P$1 U$605.5(EN1) ; also sheet 1
VDD_5V_IN [power]: L603.P$1 R609.P$2 U$604.1(IN) ; also sheet 6,8
VDD_5V_PERIPH [power]: U$604.8(OUT) ; also sheet 2,4
VDD_5V_SENS: R609.P$1 R610.P$1 ; also sheet 1

### Notes on the sheet
- Bypass caps as close to device pins as possible.
- Note: Maximise copper area connected 
  to center ground pad.
- POR reset 
  delay 1s / uF
- Current Limits:
  I(limit) = 25000 / R(ilim)
  25K = 1A, 16K5 = 1.5A
- FMU Power and Reset

## Sheet 8 of 12
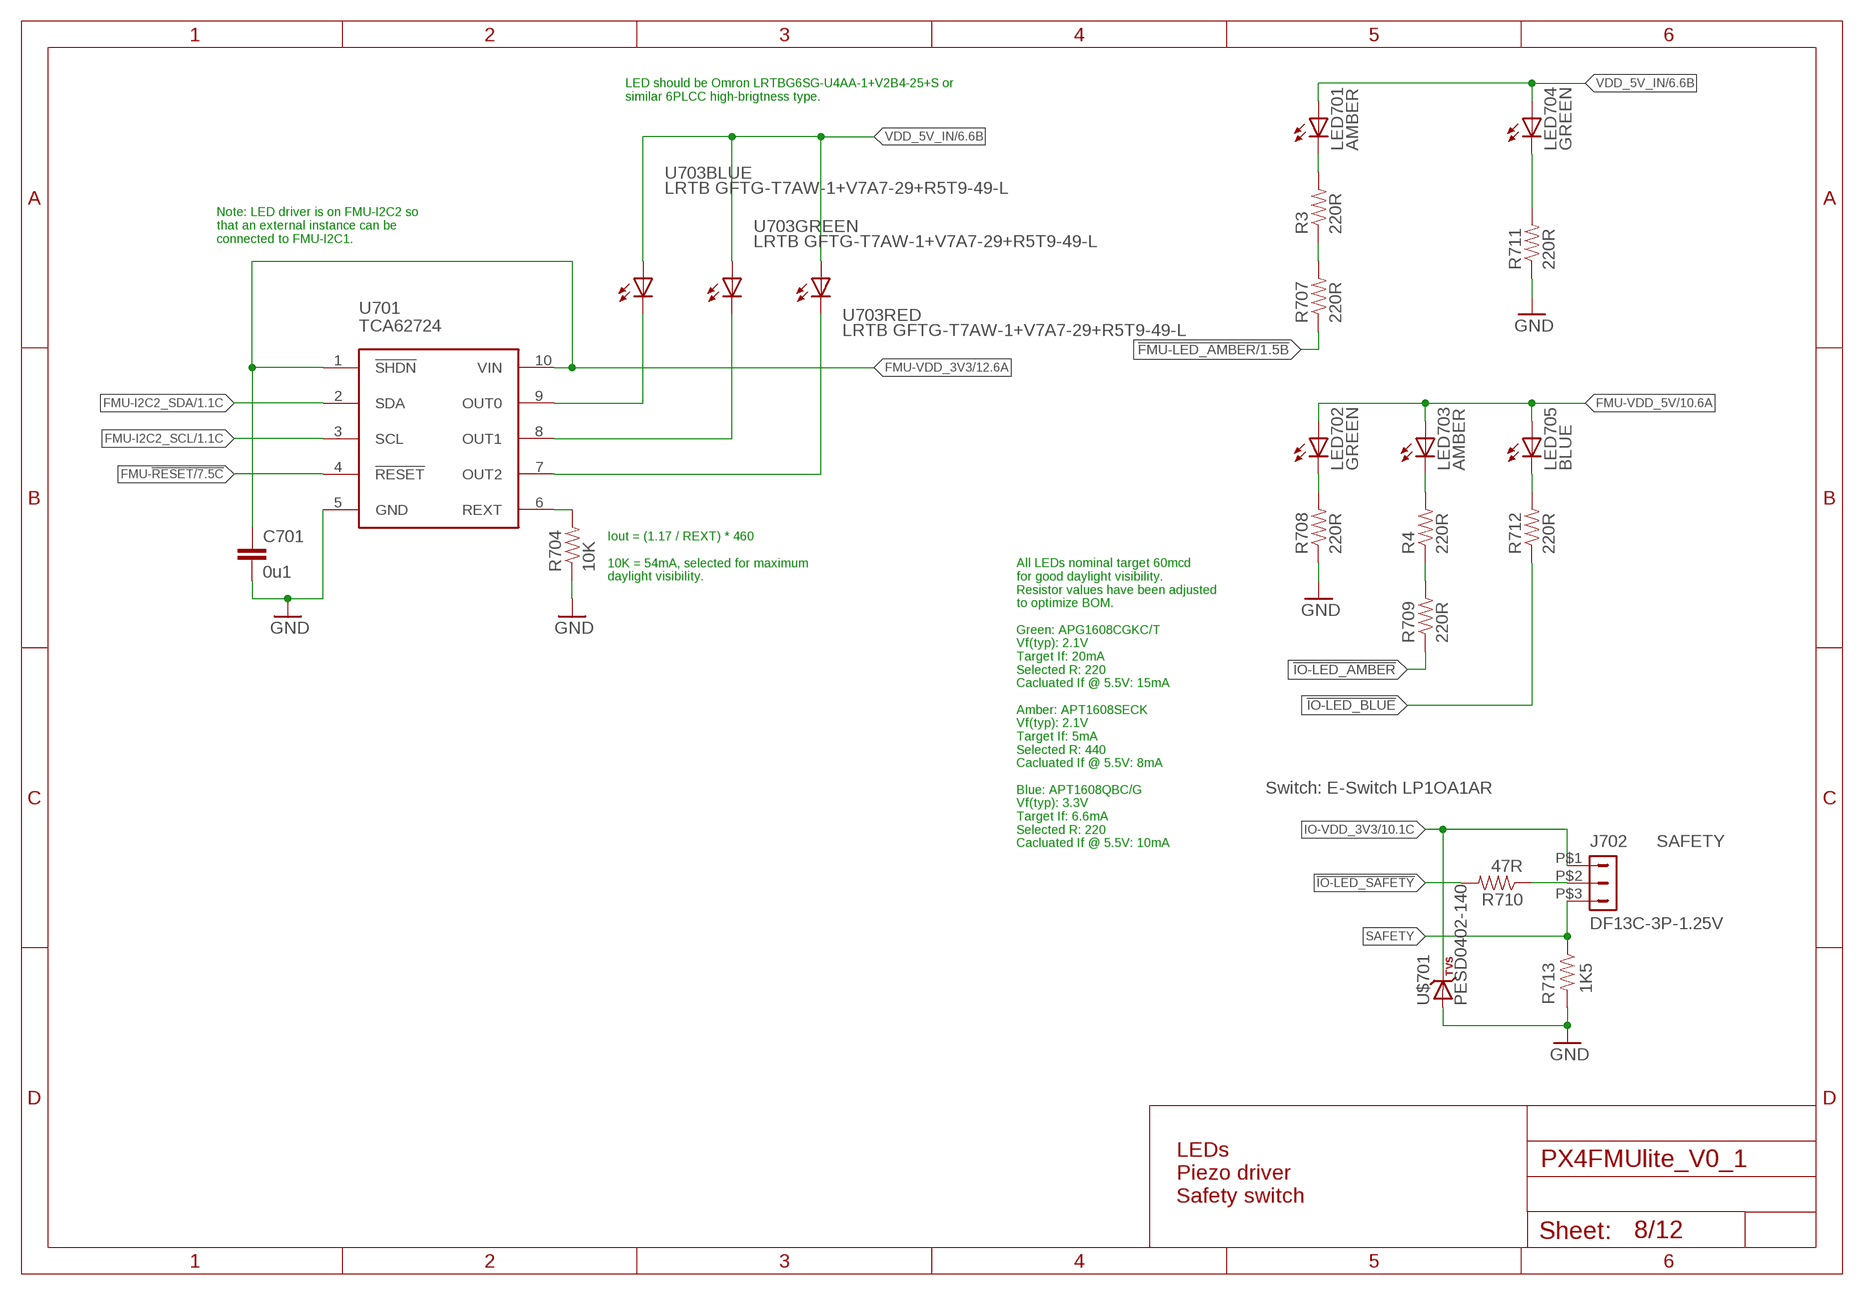
[diagram p7: schematic, sheet 8]

### Parts
C701  0u1  CAP0402  [0402-CAP]
J702  DF13C-3P-1.25V  DF13-3P-1.25V  [DF13C-3P-1.25V]
LED701  AMBER  LED0603  [0603-LED]
LED702  GREEN  LED0603  [0603-LED]
LED703  AMBER  LED0603  [0603-LED]
LED704  GREEN  LED0603  [0603-LED]
LED705  BLUE  LED0603  [0603-LED]
R3  220R  RESISTOR0402-RES  [0402-RES]
R4  220R  RESISTOR0402-RES  [0402-RES]
R704  10K  RESISTOR0402-RES  [0402-RES]
R707  220R  RESISTOR0402-RES  [0402-RES]
R708  220R  RESISTOR0402-RES  [0402-RES]
R709  220R  RESISTOR0402-RES  [0402-RES]
R710  47R  RESISTOR0402-RES  [0402-RES]
R711  220R  RESISTOR0402-RES  [0402-RES]
R712  220R  RESISTOR0402-RES  [0402-RES]
R713  1K5  RESISTOR0402-RES  [0402-RES]
U701  TCA62724FMG  [SON10]
U703  LRTB GFTG-T7AW-1+V7A7-29+R5T9-49-L  RGB-LED6-PLCC  [6-PLCC]
U$701  PESD0402-140  DIODE-TVS  [0402-TVS]

### Nets
!FMU-LED_AMBER: R707.P$1 ; also sheet 1
!IO-LED_AMBER: R709.P$1
!IO-LED_BLUE: R712.P$1
!IO-LED_SAFETY: R710.P$2
FMU-!RESET: U701.4(!RESET) ; also sheet 7
FMU-I2C2_SCL: U701.3(SCL) ; also sheet 1,3
FMU-I2C2_SDA: U701.2(SDA) ; also sheet 1,3
FMU-VDD_3V3 [power]: C701.P$1 U701.1(!SHDN) U701.10(VIN) ; also sheet 1,3,4,7,12
FMU-VDD_5V [power]: LED702.A LED703.A LED705.A ; also sheet 10,11
GNDX [power]: C701.P$2 R704.P$1 R708.P$1 R711.P$1 R713.P$2 U701.5(GND) U$701.A ; supply symbol labelled GND ; also sheet 1,2,3,4,5,6,7,9,10,11,12
IO-VDD_3V3 [power]: J702.P$1 U$701.C ; also sheet 10,11
N$7: LED704.C R711.P$2
N$9: LED705.C R712.P$2
N$13: R3.P$1 R707.P$2
N$26: LED701.C R3.P$2
N$29: LED702.C R708.P$2
N$39: R4.P$1 R709.P$2
N$40: LED703.C R4.P$2
N$57: J702.P$2 R710.P$1
N$95: R704.P$2 U701.6(REXT)
RGB_LED_3: U701.9(OUT0) U703.C1(BLUE:C)
RGB_LED_4: U701.8(OUT1) U703.C2(GREEN:C)
RGB_LED_14: U701.7(OUT2) U703.C3(RED:C)
SAFETY: J702.P$3 R713.P$1
VDD_5V_IN [power]: LED701.A LED704.A U703.A1(BLUE:A) U703.A2(GREEN:A) U703.A3(RED:A) ; also sheet 6,7

### Notes on the sheet
- LED should be Omron LRTBG6SG-U4AA-1+V2B4-25+S or 
  similar 6PLCC high-brigtness type.
- Note: LED driver is on FMU-I2C2 so
  that an external instance can be
  connected to FMU-I2C1.
- Iout = (1.17 / REXT) * 460
  
  10K = 54mA, selected for maximum
  daylight visibility.
- Switch: E-Switch LP1OA1AR
- All LEDs nominal target 60mcd
  for good daylight visibility.
  Resistor values have been adjusted
  to optimize BOM.
  
  Green: APG1608CGKC/T
  Vf(typ): 2.1V
  Target If: 20mA
  Selected R: 220
  Cacluated If @ 5.5V: 15mA
  
  Amber: APT1608SECK
  Vf(typ): 2.1V
  Target If: 5mA
  Selected R: 440
  Cacluated If @ 5.5V: 8mA
  
  Blue: APT1608QBC/G
  Vf(typ): 3.3V
  Target If: 6.6mA
  Selected R: 220
  Cacluated If @ 5.5V: 10mA
- SAFETY
- LEDs
  Piezo driver
  Safety switch

## Sheet 9 of 12
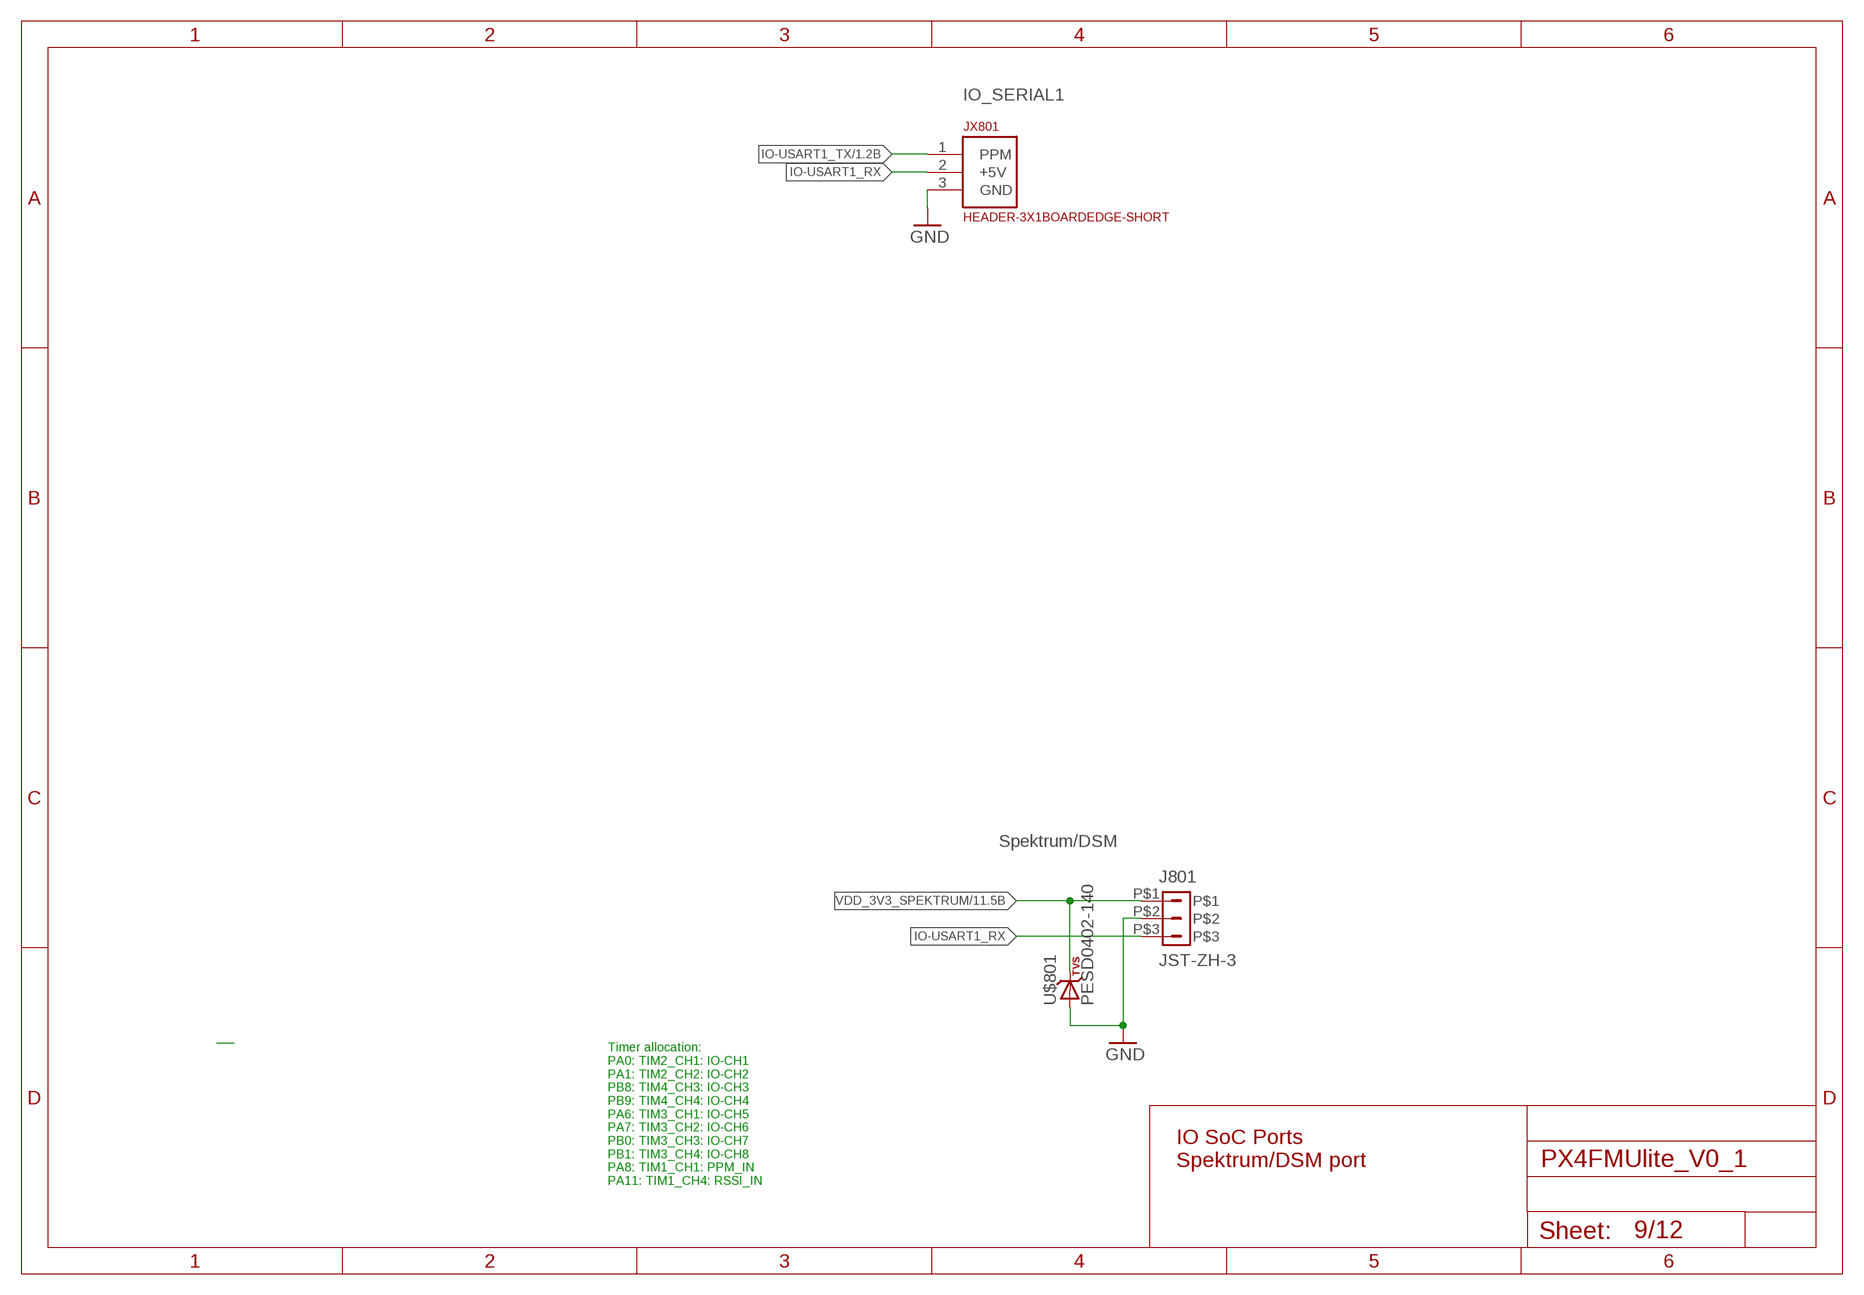
[diagram p8: schematic, sheet 9]

### Parts
J801  JST-ZH-3  [JST-ZH-SMT-VERTICAL]
JX801  HEADER-3X1BOARDEDGE-SHORT  [HEADER_3X01_SMD_H_BOARD_EDGE_SHORT]
U$801  PESD0402-140  DIODE-TVS  [0402-TVS]

### Nets
GNDX [power]: J801.P$2 JX801.3(GND) U$801.A ; supply symbol labelled GND ; also sheet 1,2,3,4,5,6,7,8,10,11,12
IO-USART1_RX: J801.P$3 JX801.2(+5V)
IO-USART1_TX: JX801.1(PPM) ; also sheet 1
VDD_3V3_SPEKTRUM [power]: J801.P$1 U$801.C ; also sheet 11

### Notes on the sheet
- IO_SERIAL1
- Spektrum/DSM
- IO SoC Ports
  Spektrum/DSM port
- Timer allocation:
  PA0: TIM2_CH1: IO-CH1
  PA1: TIM2_CH2: IO-CH2
  PB8: TIM4_CH3: IO-CH3
  PB9: TIM4_CH4: IO-CH4
  PA6: TIM3_CH1: IO-CH5
  PA7: TIM3_CH2: IO-CH6
  PB0: TIM3_CH3: IO-CH7
  PB1: TIM3_CH4: IO-CH8
  PA8: TIM1_CH1: PPM_IN
  PA11: TIM1_CH4: RSSI_IN

## Sheet 10 of 12
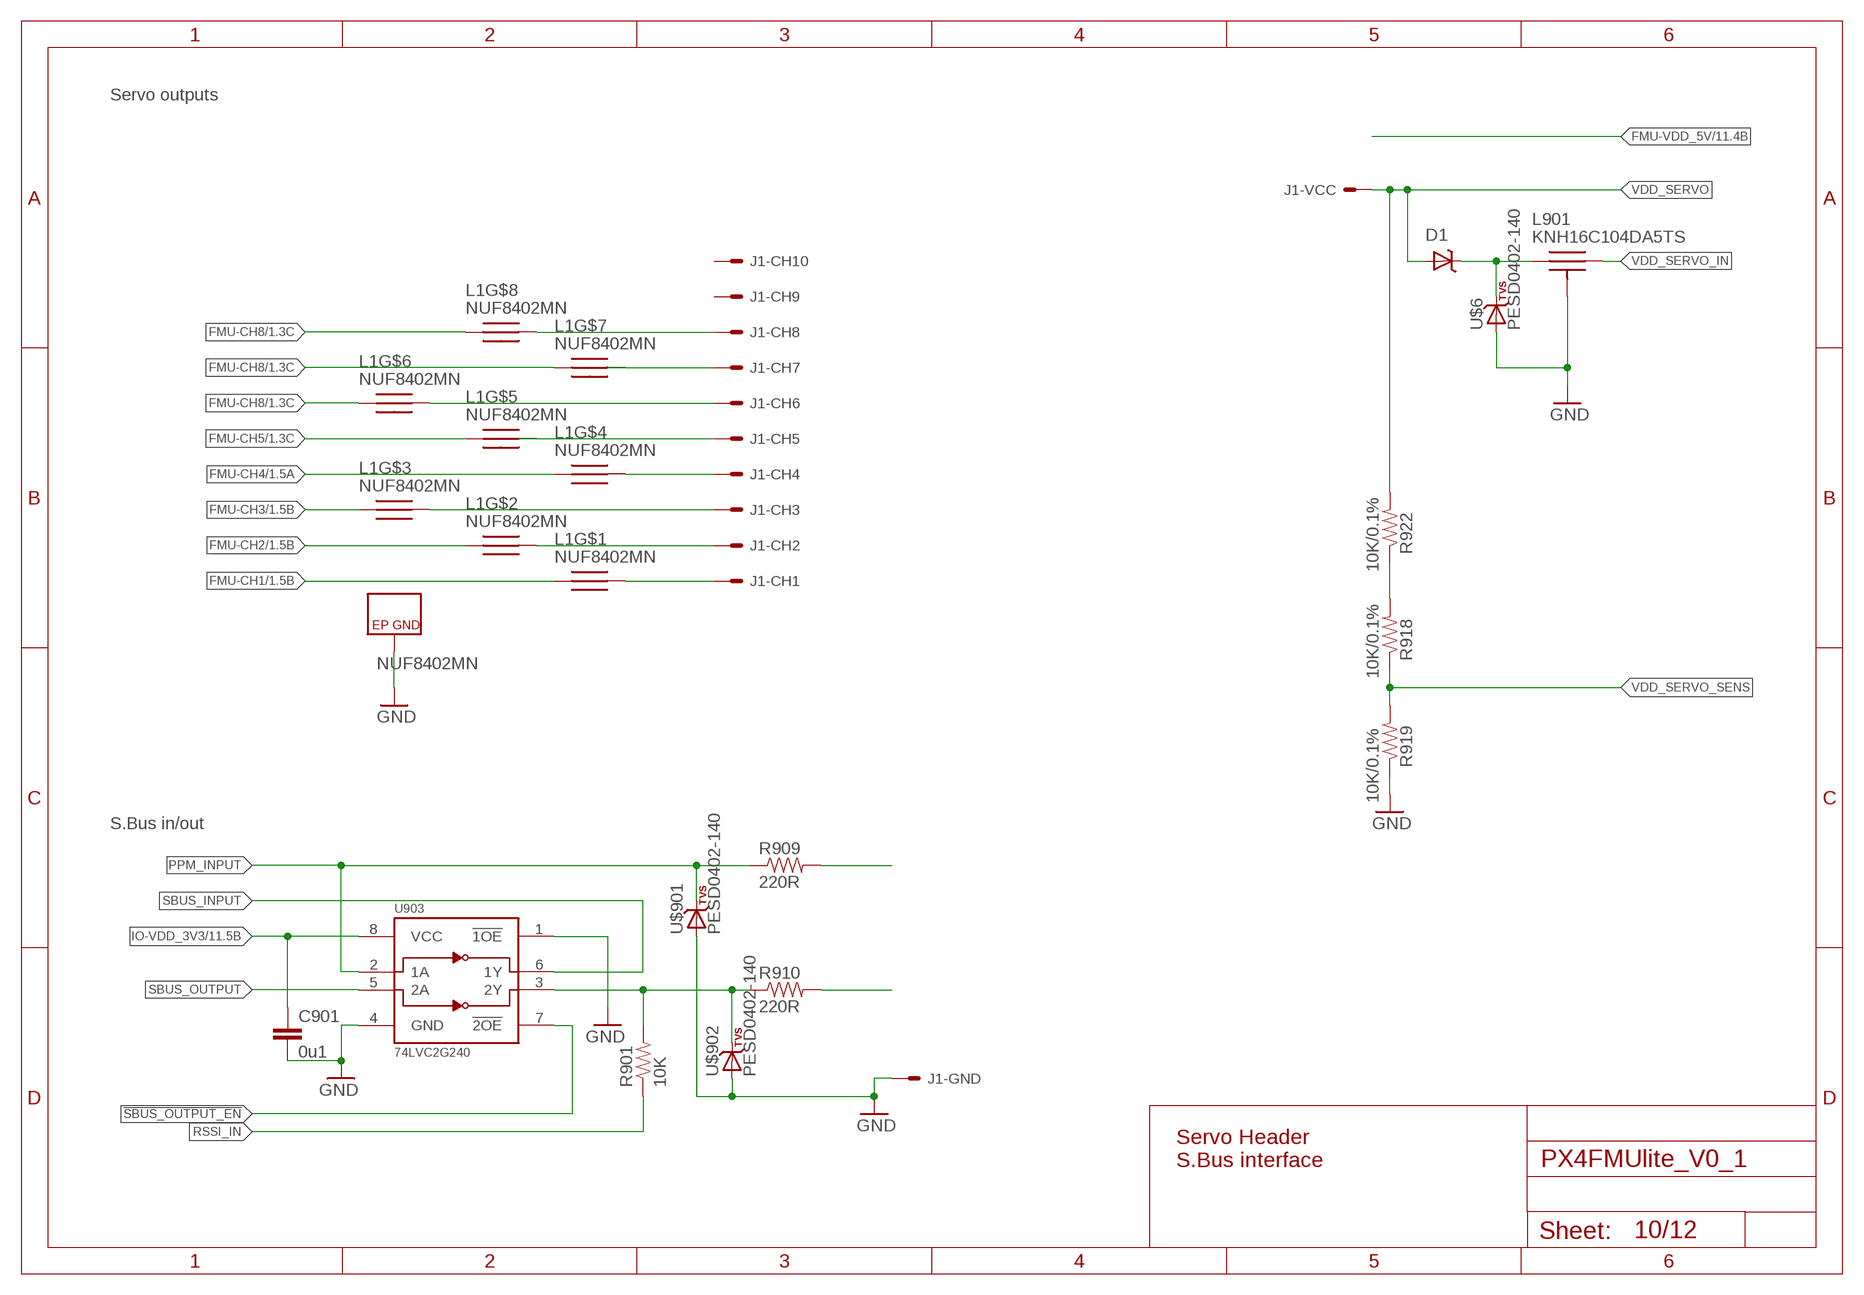
[diagram p9: schematic, sheet 10]

### Parts
C901  0u1  CAP0402  [0402-CAP]
D1  MSS1P4-M3  DIODE-SCHOTTKY_MSMP  [MICROSMP]
J1  HEADER-3X10  [3X10RA]
L1  NUF8402MN  [DFN16-THIN]
L901  KNH16C104DA5TS  [KYOCERA-KNH16-DA]
R901  10K  RESISTOR0402-RES  [0402-RES]
R909  220R  RESISTOR0402-RES  [0402-RES]
R910  220R  RESISTOR0402-RES  [0402-RES]
R918  10K/0.1%  RESISTOR0402-RES  [0402-RES]
R919  10K/0.1%  RESISTOR0402-RES  [0402-RES]
R922  10K/0.1%  RESISTOR0402-RES  [0402-RES]
U903  74LVC2G240  74LVC2G240-TSSOP-8  [TSSOP8_SOT505-2]
U$6  PESD0402-140  DIODE-TVS  [0402-TVS]
U$901  PESD0402-140  DIODE-TVS  [0402-TVS]
U$902  PESD0402-140  DIODE-TVS  [0402-TVS]

### Nets
!SBUS_OUTPUT_EN: U903.7(!2OE)
FMU-CH1-PROT: J1.1 L1.P$16
GNDX [power]: C901.P$2 J1.3 J1.6 J1.9 J1.12 J1.15 J1.18 J1.21 J1.24 J1.27 J1.30 L901.P$3 L901.P$4 L901.P$5 R919.P$1 U903.1(!1OE) U903.4(GND) U$6.A U$901.A U$902.A ; supply symbol labelled GND ; also sheet 1,2,3,4,5,6,7,8,9,11,12
IO-VDD_3V3 [power]: C901.P$1 U903.8(VCC) ; also sheet 8,11
N$3: R918.P$2 R922.P$1
N$15: J1.22 L1.P$9
N$16: J1.19
N$18: L1.P$8
N$32: L1.P$7
N$36: J1.16 L1.P$11
N$38: R901.P$2 R910.P$1 U903.3(2Y) U$902.C
N$68: J1.13
N$77: J1.10 L1.P$13
N$78: J1.7 L1.P$14
N$79: J1.4 L1.P$15
N$99: R910.P$2
N$110 [power]: D1.CATHODE(C) L901.P$1 U$6.C
PPM-SBUS-PROT: R909.P$2
PPM_INPUT: R909.P$1 U903.2(1A) U$901.C
RSSI_IN: R901.P$1
SBUS_INPUT: U903.6(1Y)
SBUS_OUTPUT: U903.5(2A)
VDD_SERVO [power]: D1.ANODE(A) J1.2 J1.5 J1.8 J1.11 J1.14 J1.17 J1.20 J1.23 J1.26 J1.29 R922.P$2
VDD_SERVO_IN [power]: L901.P$2
VDD_SERVO_SENS: R918.P$1 R919.P$2
Unconnected: J1.25 J1.28 L1.P$1 L1.P$2 L1.P$3 L1.P$4 L1.P$5 L1.P$6 L1.P$10 L1.P$12

### Notes on the sheet
- Servo outputs
- S.Bus in/out
- Servo Header
  S.Bus interface

## Sheet 11 of 12
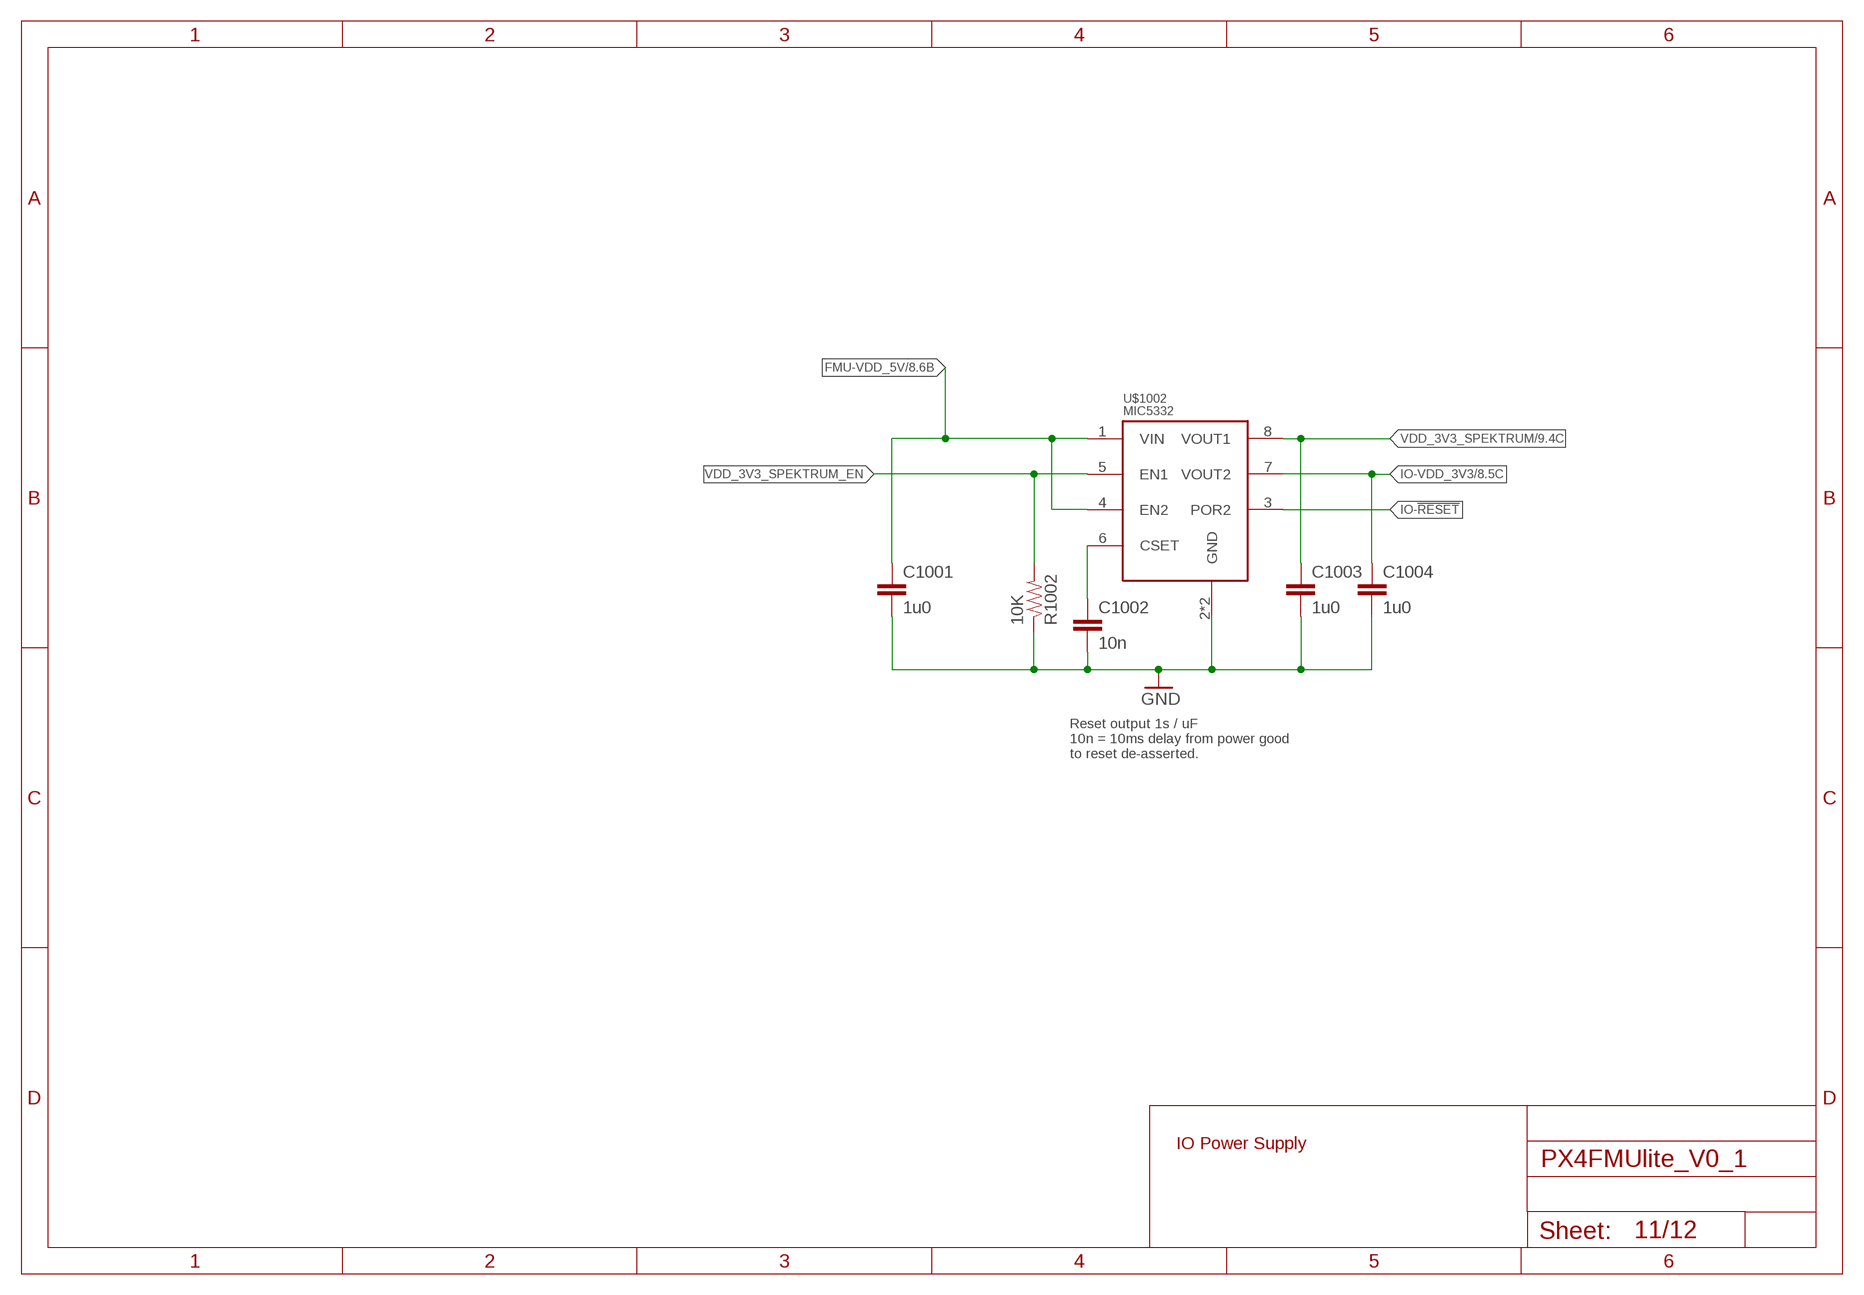
[diagram p10: schematic, sheet 11]

### Parts
C1001  1u0  CAP0603  [0603-CAP]
C1002  10n  CAP0402  [0402-CAP]
C1003  1u0  CAP0603  [0603-CAP]
C1004  1u0  CAP0603  [0603-CAP]
R1002  10K  RESISTOR0402-RES  [0402-RES]
U$1002  MIC5332  [MLF-8-EPAD]

### Nets
FMU-VDD_5V [power]: C1001.P$1 U$1002.1(VIN) U$1002.4(EN2) ; also sheet 8,10
GNDX [power]: C1001.P$2 C1002.P$2 C1003.P$2 C1004.P$2 R1002.P$1 U$1002.2(GND) U$1002.GND ; supply symbol labelled GND ; also sheet 1,2,3,4,5,6,7,8,9,10,12
IO-!RESET: U$1002.3(POR2)
IO-VDD_3V3 [power]: C1004.P$1 U$1002.7(VOUT2) ; also sheet 8,10
N$104: C1002.P$1 U$1002.6(CSET)
VDD_3V3_SPEKTRUM [power]: C1003.P$1 U$1002.8(VOUT1) ; also sheet 9
VDD_3V3_SPEKTRUM_EN: R1002.P$2 U$1002.5(EN1)

### Notes on the sheet
- Reset output 1s / uF
  10n = 10ms delay from power good
  to reset de-asserted.
- IO Power Supply

## Sheet 12 of 12
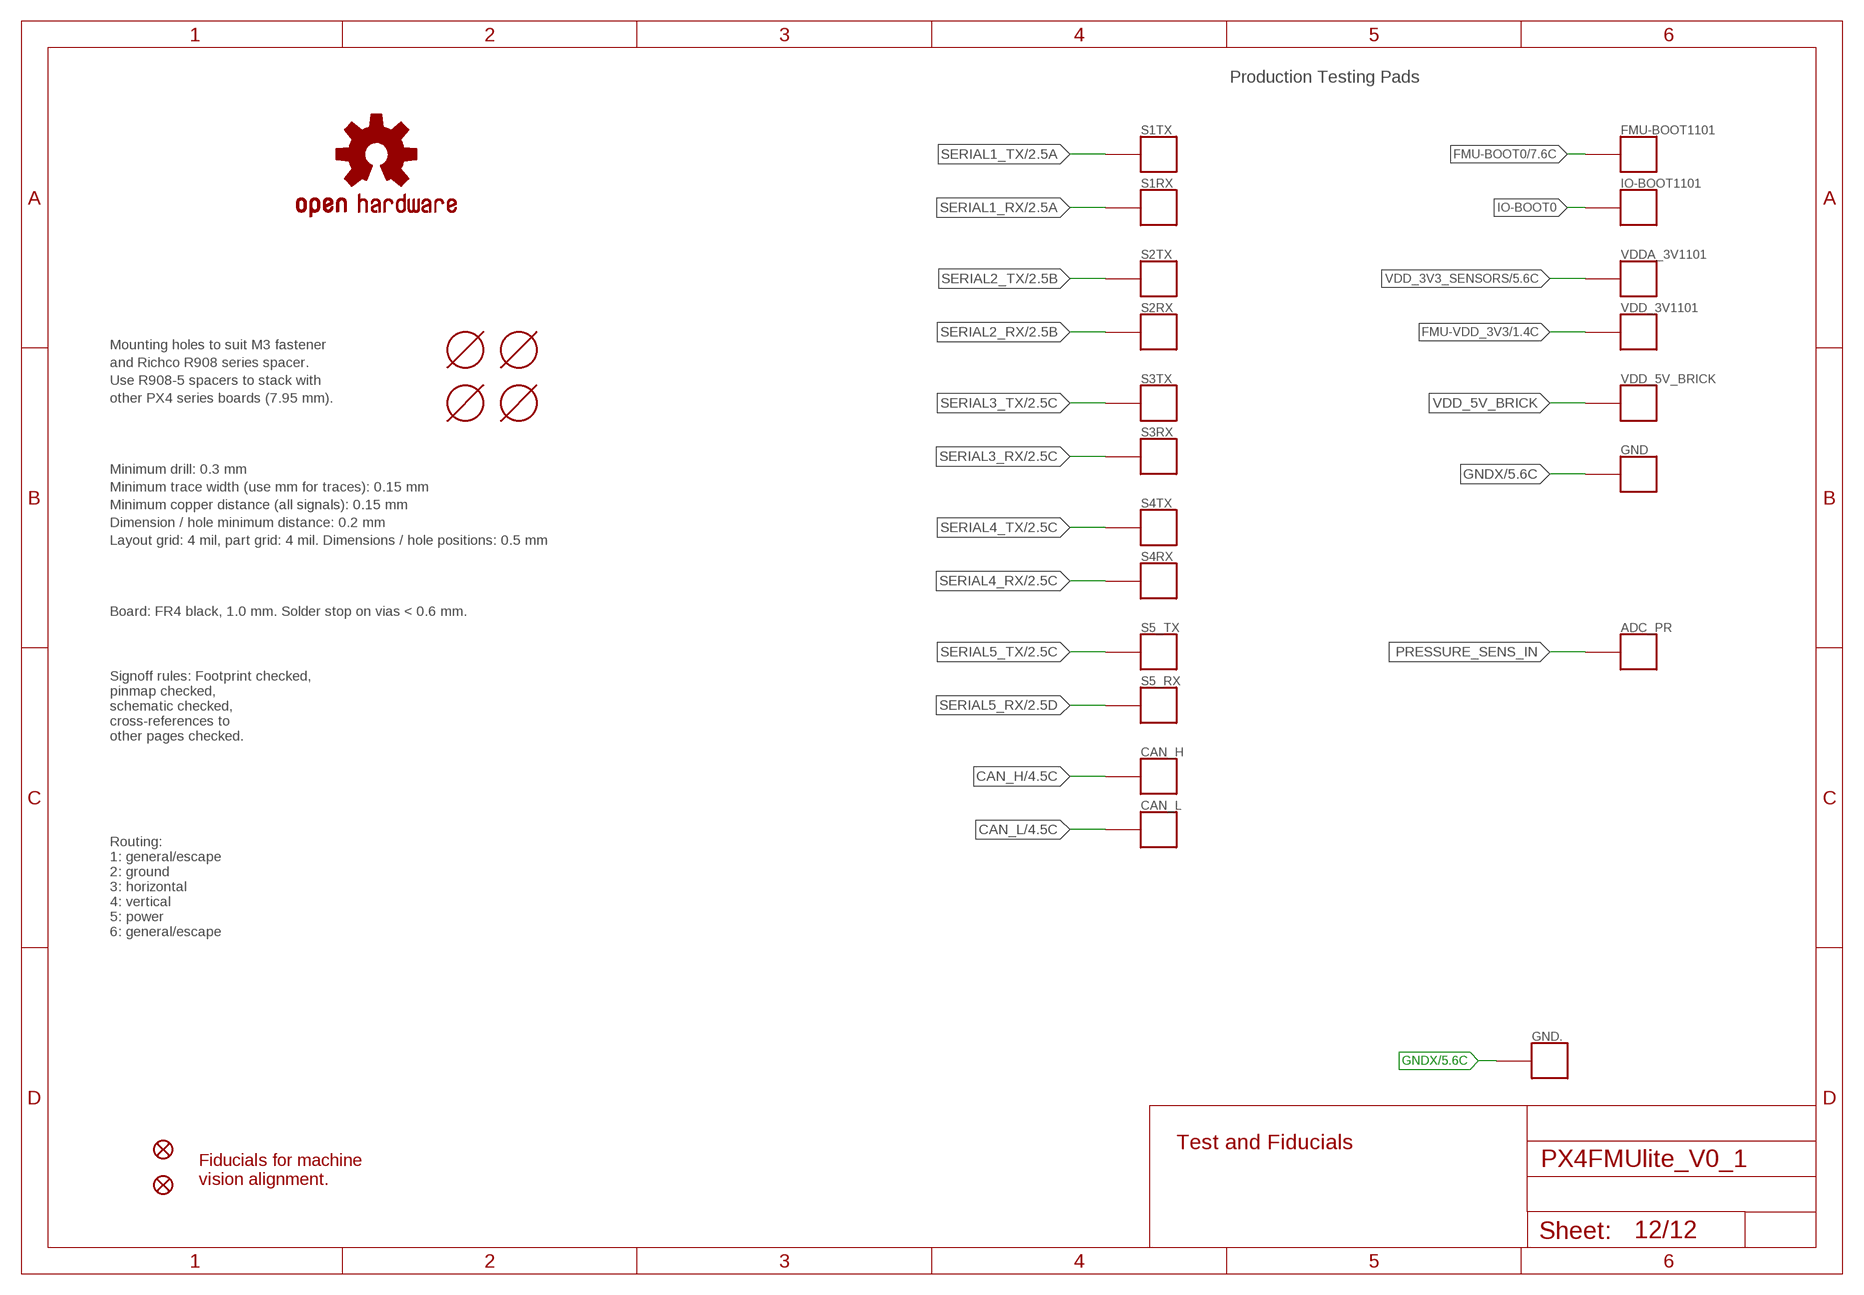
[diagram p11: schematic, sheet 12]

### Parts
ADC_PR  PAD.04  [PAD.04X.04]
CAN_H  PAD.04  [PAD.04X.04]
CAN_L  PAD.04  [PAD.04X.04]
FMU-BOOT1101  PAD.04  [PAD.04X.04]
GND  PAD.04  [PAD.04X.04]
GND.  PAD.04  [PAD.04X.04]
IO-BOOT1101  PAD.04  [PAD.04X.04]
JP1  FIDUCIAL1.5X3  [FIDUCIAL-1.5X3]
JP2  FIDUCIAL1.5X3  [FIDUCIAL-1.5X3]
M3_MOUNT1101  MOUNT-HOLE3.1MM  [MOUNT-HOLE3.1]
M3_MOUNT1102  MOUNT-HOLE3.1MM  [MOUNT-HOLE3.1]
M3_MOUNT1103  MOUNT-HOLE3.1MM  [MOUNT-HOLE3.1]
M3_MOUNT1104  MOUNT-HOLE3.1MM  [MOUNT-HOLE3.1]
OSHW_LOGO  OSHW-LOGOS  [OSHW-LOGO-S]
S1RX  PAD.04  [PAD.04X.04]
S1TX  PAD.04  [PAD.04X.04]
S2RX  PAD.04  [PAD.04X.04]
S2TX  PAD.04  [PAD.04X.04]
S3RX  PAD.04  [PAD.04X.04]
S3TX  PAD.04  [PAD.04X.04]
S4RX  PAD.04  [PAD.04X.04]
S4TX  PAD.04  [PAD.04X.04]
S5_RX  PAD.04  [PAD.04X.04]
S5_TX  PAD.04  [PAD.04X.04]
VDD_3V1101  PAD.04  [PAD.04X.04]
VDD_5V_BRICK  PAD.04  [PAD.04X.04]
VDDA_3V1101  PAD.04  [PAD.04X.04]

### Nets
CAN_H: CAN_H.P$1 ; also sheet 4
CAN_L: CAN_L.P$1 ; also sheet 4
FMU-BOOT0: FMU-BOOT1101.P$1 ; also sheet 7
FMU-VDD_3V3 [power]: VDD_3V1101.P$1 ; also sheet 1,3,4,7,8
GNDX [power]: GND..P$1 GND.P$1 ; also sheet 1,2,3,4,5,6,7,8,9,10,11
IO-BOOT0: IO-BOOT1101.P$1 ; also sheet 9
PRESSURE_SENS_IN: ADC_PR.P$1
SERIAL1_RX: S1RX.P$1 ; also sheet 2
SERIAL1_TX: S1TX.P$1 ; also sheet 2
SERIAL2_RX: S2RX.P$1 ; also sheet 2
SERIAL2_TX: S2TX.P$1 ; also sheet 2
SERIAL3_RX: S3RX.P$1 ; also sheet 2
SERIAL3_TX: S3TX.P$1 ; also sheet 2
SERIAL4_RX: S4RX.P$1 ; also sheet 2
SERIAL4_TX: S4TX.P$1 ; also sheet 2
SERIAL5_RX: S5_RX.P$1 ; also sheet 2
SERIAL5_TX: S5_TX.P$1 ; also sheet 2
VDD_3V3_SENSORS [power]: VDDA_3V1101.P$1 ; also sheet 5,7
VDD_5V_BRICK [power]: VDD_5V_BRICK.P$1

### Notes on the sheet
- Production Testing Pads
- Mounting holes to suit M3 fastener
- and Richco R908 series spacer.
- Use R908-5 spacers to stack with
- other PX4 series boards (7.95 mm).
- Minimum drill: 0.3 mm
- Minimum trace width (use mm for traces): 0.15 mm
- Minimum copper distance (all signals): 0.15 mm
- Dimension / hole minimum distance: 0.2 mm
- Layout grid: 4 mil, part grid: 4 mil. Dimensions / hole positions: 0.5 mm
- Board: FR4 black, 1.0 mm. Solder stop on vias < 0.6 mm.
- Signoff rules: Footprint checked,
  pinmap checked,
  schematic checked, 
  cross-references to
  other pages checked.
- Routing:
  1: general/escape
  2: ground
  3: horizontal
  4: vertical
  5: power
  6: general/escape
- Test and Fiducials
- Fiducials for machine
  vision alignment.

## Power pins joined to a net without a drawn wire
GNDX: L1.P$EP(GND) L2.P$EP(GND) L3.P$EP(GND)

## Library data of the parts
ADC_PR CAN_H CAN_L FMU-BOOT1101 GND GND. IO-BOOT1101 S1RX S1TX S2RX S2TX S3RX S3TX S4RX S4TX S5_RX S5_TX VDD_3V1101 VDD_5V_BRICK VDDA_3V1101 = pixhawk2:PAD: Test pad This footprint includes three classes: The actual test pads, a pogo-pin footprint to mount the pogo-pin as through-hole part and a hole footprint which allows the head of the pogo-pin to pass through (do NOT use the hole to mount the pogo-pin). In a typical test setup, the stack would consist of three PCBs: The actual PCB under testing with a test pad on the bottom, then a second PCB with the hole for the pogo-pin head where the PCB under testing is pressed on and a third PCB at 30 mm / 1.2" distance with the pogo-pin footprints. The pogo-pins are soldered to the last PCB. To create the stack, copy the board under testing and exchange the footprints - this way the correct positioning is ensured.; BOM: EXCLUDE; PARTNO: *
C101 C402 C503 C507 C508 C606-C610 C612 C701 C901 = pixhawk2:CAP: Capacitor Standard 0603 ceramic capacitor, and 0.1" leaded capacitor.; PARTNO: CC0402ZRY5V7BB104
C102 C103 = pixhawk2:CAP: Capacitor Standard 0603 ceramic capacitor, and 0.1" leaded capacitor.; PARTNO: C1005C0G1H080C
C505 C602 C1002 = pixhawk2:CAP: Capacitor Standard 0603 ceramic capacitor, and 0.1" leaded capacitor.; PARTNO: CC0402KRX7R7BB103
C506 C509 C604 = pixhawk2:CAP: Capacitor Standard 0603 ceramic capacitor, and 0.1" leaded capacitor.; PARTNO: CC0805ZKY5V6BB106
C510 = pixhawk2:CAP: Capacitor Standard 0603 ceramic capacitor, and 0.1" leaded capacitor.; PARTNO: C1005X5R1C474K050BC
C601 C611 C613 = pixhawk2:CAP: Capacitor Standard 0603 ceramic capacitor, and 0.1" leaded capacitor.; PARTNO: C1608Y5V1C225Z
C603 C605 C1001 C1003 C1004 = pixhawk2:CAP: Capacitor Standard 0603 ceramic capacitor, and 0.1" leaded capacitor.; PARTNO: CC0603ZRY5V7BB105
D1 = pixhawk2:DIODE-SCHOTTKY: Schottky barrier diode in DO214AC, e.g. Fairchild SS14.; PARTNO: MSS1P4-M3/89A
J1 = PX4lite:HEADER-3X10: 3x10 servo header
J201-J204 = con-hirose-df13:DF13-6P-1.25: DF13-6P 1.25mm Pitch Miniature Crimping Connector.; PARTNO: DF13C-6P-1.25V(20)
J301 = pixhawk2:MOLEX-47346-0001: MICRO USB B, BOTTOM MOUNT; PARTNO: 47346-0001
J302 J401 J405 = con-hirose-df13:DF13-4P-1.25: DF13-4P 1.25mm Pitch Miniature Crimping Connector.; PARTNO: DF13C-4P-1.25V(20)
J403 = con-hirose-df13:DF13-7P-1.25: DF13-7P 1.25mm Pitch Miniature Crimping Connector.; PARTNO: DF13C-7P-1.25V(20)
J404 = con-hirose-df13:DF13-5P-1.25: DF13-5P 1.25mm Pitch Miniature Crimping Connector.; PARTNO: DF13C-5P-1.25V(20)
J702 = con-hirose-df13:DF13-3P-1.25: DF13-3P 1.25mm Pitch Miniature Crimping Connector.; PARTNO: DF13C-3P-1.25V(20)
J801 = for-transfers:JST-ZH-3; PARTNO: B3B-ZR-SM4-TF (LF)(SN)(P)
JP1 JP2 = pixhawk2:FIDUCIAL: Fiducial Alignment Points Various fiducial points for machine vision alignment.; BOM: EXCLUDE; PARTNO: *
JX301 = pixhawk2:ARM_MINI_JTAG: CONNECTOR wire to board 1.25 mm (.049 inch) pitch header; BOM: EXCLUDE; PARTNO: M50-3900542
JX801 = pixhawk2:HEADER-3X1: Single row 0.1" servo header; BOM: EXCLUDE
L1-L3 = PX4lite:NUF8402MN: NUF8402 OnSemi ESD and EMI filter
L201-L203 L402-L404 L601-L603 L901 = pixhawk2:KNH16C104DA5TS: Kyocera KNH16C104DA5TS EMI filter; PARTNO: KNH16C104DA5TS
LED701 LED703 = pixhawk2:LED: LEDs Standard schematic elements and footprints for 5mm, 3mm, 1206, and 0603 sized LEDs. 5mm - Spark Fun Electronics SKU : COM-00529 (and others); PARTNO: APTD1608SECK
LED702 LED704 = pixhawk2:LED: LEDs Standard schematic elements and footprints for 5mm, 3mm, 1206, and 0603 sized LEDs. 5mm - Spark Fun Electronics SKU : COM-00529 (and others); PARTNO: APTD1608CGCK
LED705 = pixhawk2:LED: LEDs Standard schematic elements and footprints for 5mm, 3mm, 1206, and 0603 sized LEDs. 5mm - Spark Fun Electronics SKU : COM-00529 (and others); PARTNO: APTD1608QBC/D
M3_MOUNT1101-M3_MOUNT1104 = pixhawk2:MOUNT-HOLE; BOM: EXCLUDE; PARTNO: *
OSHW_LOGO = pixhawk2:OSHW-LOGO: Open Source Hardware Logo This logo indicates the piece of hardware it is found on incorporates a OSHW license and/or adheres to the definition of open source hardware found here: http://freedomdefined.org/OSHW; BOM: EXCLUDE; PARTNO: *
R3 R4 R707-R709 R711 R712 R909 R910 = pixhawk2:RESISTOR: Resistor Basic schematic elements and footprints for 0603, 1206, and PTH 1/10th watt (small) resistors.; PARTNO: RC0402FR-07220RL
R12 R13 R404 R405 R409 = pixhawk2:RESISTOR: Resistor Basic schematic elements and footprints for 0603, 1206, and PTH 1/10th watt (small) resistors.; PARTNO: RC0402FR-07120RL
R101 = pixhawk2:RESISTOR: Resistor Basic schematic elements and footprints for 0603, 1206, and PTH 1/10th watt (small) resistors.; PARTNO: RC0402FR-07470RL
R102 R603 R607 R611 R704 R901 R1002 = pixhawk2:RESISTOR: Resistor Basic schematic elements and footprints for 0603, 1206, and PTH 1/10th watt (small) resistors.; PARTNO: RC0402FR-0710KL
R301-R305 = pixhawk2:RESISTOR: Resistor Basic schematic elements and footprints for 0603, 1206, and PTH 1/10th watt (small) resistors.; PARTNO: RC0402FR-07100KL
R306 R307 R401 R402 R713 = pixhawk2:RESISTOR: Resistor Basic schematic elements and footprints for 0603, 1206, and PTH 1/10th watt (small) resistors.; PARTNO: RC0402FR-071K5L
R407 R408 R604 R605 R609 R610 R918 R919 R922 = pixhawk2:RESISTOR: Resistor Basic schematic elements and footprints for 0603, 1206, and PTH 1/10th watt (small) resistors.; PARTNO: ERA-2AEB103X
R606 = pixhawk2:RESISTOR: Resistor Basic schematic elements and footprints for 0603, 1206, and PTH 1/10th watt (small) resistors.; PARTNO: RMCF0402FT25K5
R608 = pixhawk2:RESISTOR: Resistor Basic schematic elements and footprints for 0603, 1206, and PTH 1/10th watt (small) resistors.; PARTNO: RC0402FR-071KL
R710 = pixhawk2:RESISTOR: Resistor Basic schematic elements and footprints for 0603, 1206, and PTH 1/10th watt (small) resistors.; PARTNO: RC0402JR-0747RL
S601 = pixhawk2:SWITCH-MOMENTARY-2; PARTNO: EVQP7J01K
U1 = SparkFun-Sensors:MPU-6000: MPU-6000 - I2C address is 0x68 with AD0 low and 0x69 with AD0 high.
U101 = pixhawk2:STM32F4X7VX: STM32F4X7VX 100 pin LQFP STM32F407VE - 512 KB flash, no crypto STM32F407VG - 1 MB flash, no crypto STM32F417VE - 512 KB flash, with crypto STM32F417VG - 1 MB flash, with crypto; PARTNO: STM32F427VI
U102 = pixhawk2:FM25V01: FM25V01 128Kb Serial 3V F-RAM Memory; DATASHEET: http://www.ramtron.com/files/datasheets/FM25V01_ds.pdf; LINK: http://www.digikey.com/product-detail/en/FM25V01-GTR/1140-1026-1-ND/2809832; MFGPN: FM25V01; PARTNO: FM25V01-G
U301 = baseboard:MICROSDSDI; PARTNO: 2908-05WB-MG
U401 = pixhawk2:MAX3051: 3.3-V CAN TRANSCEIVER; PARTNO: MAX3051EKA
U701 = pixhawk2:TCA62724FMG: Toshiba TCA62724FMG I2C RGB LED driver; PARTNO: TCA62724FMG
U703 = pixhawk2:RGB-LED: RGB LED with separate anode/cathode terminals; PARTNO: LRTB GFTG-T7AW-1+V7A7-29+R5T9-49-L
U903 = pixhawk2:74LVC2G240: Dual inverter tri-state, 3.3V/5V compatible http://www.nxp.com/documents/data_sheet/74LVC2G240.pdf http://focus.ti.com/lit/ds/symlink/sn74lvc2g240.pdf; PARTNO: 74LVC2G240DP,125
U$1 = pixhawk2:CONN_FPC_10: 10-pin FPC connector for PX4 sensor board; PARTNO: 0781191109
U$6 U$201-U$203 U$401-U$404 U$701 U$801 U$901 U$902 = pixhawk2:DIODE-TVS; PARTNO: PESD0402-140
U$301 = pixhawk2:NUF2042XV6; PARTNO: NUF2042XV6T1G
U$604 = pixhawk2:BQ24315; PARTNO: BQ24315DSGR
U$605 U$1002 = pixhawk2:MIC5332; PARTNO: MIC5332-SSYMT
X101 = pixhawk2:OSCILLATOR: Crystal Oscillator in 3.2x2.5 SMD; PARTNO: NX3225SA-24.000000MHZ

## Net classes
0 signal: width 0.152 mm, drill 0.2 mm, clearance 0.152 mm
1 power: width 0.254 mm, drill 0.3 mm, clearance 0.152 mm

## Board
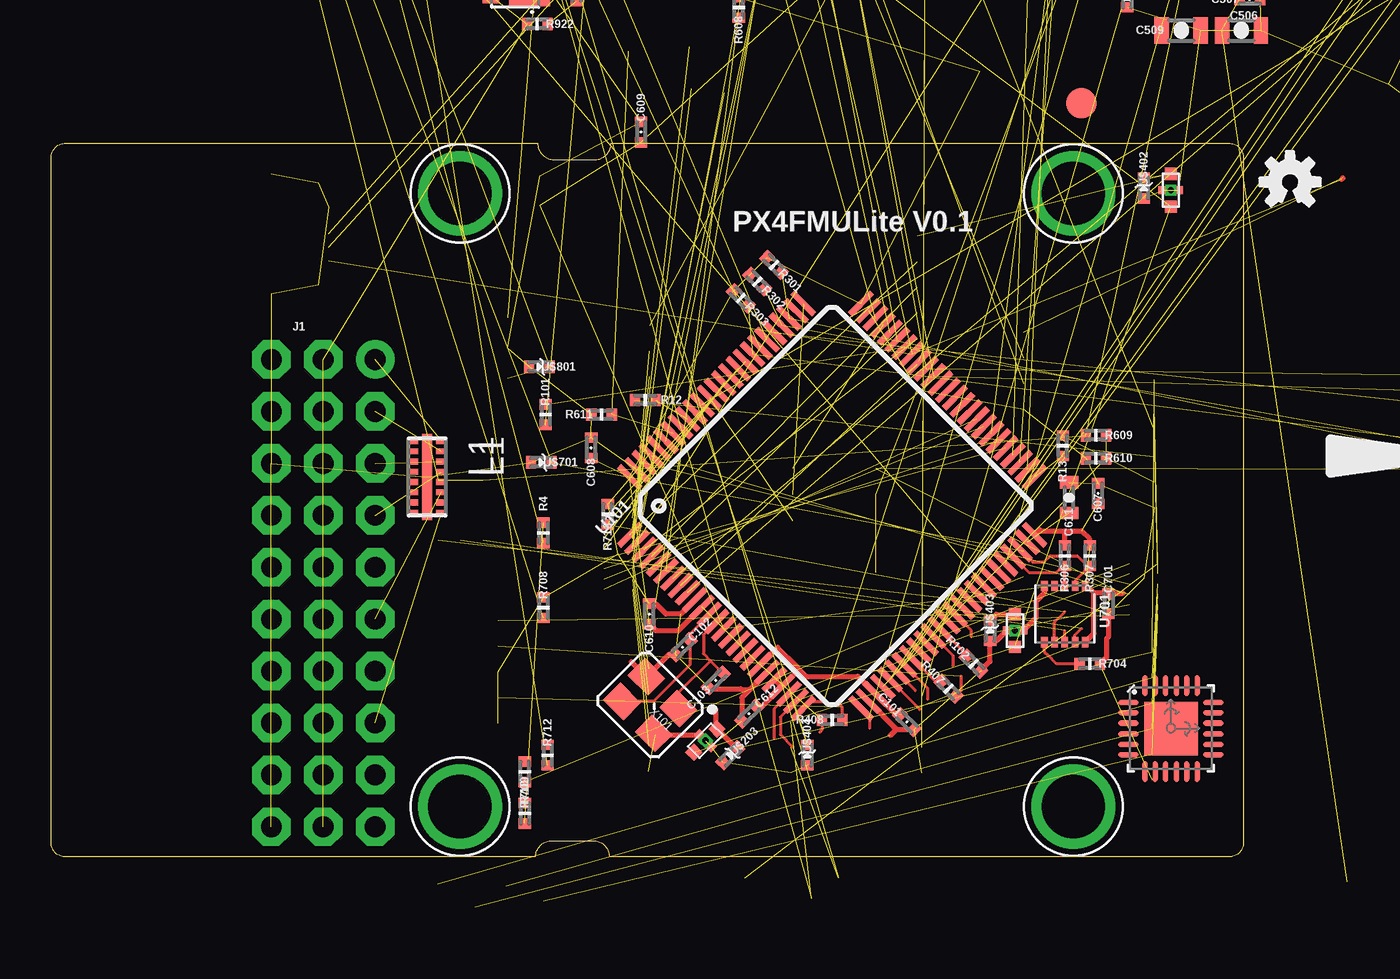
[diagram p12: board, top side]
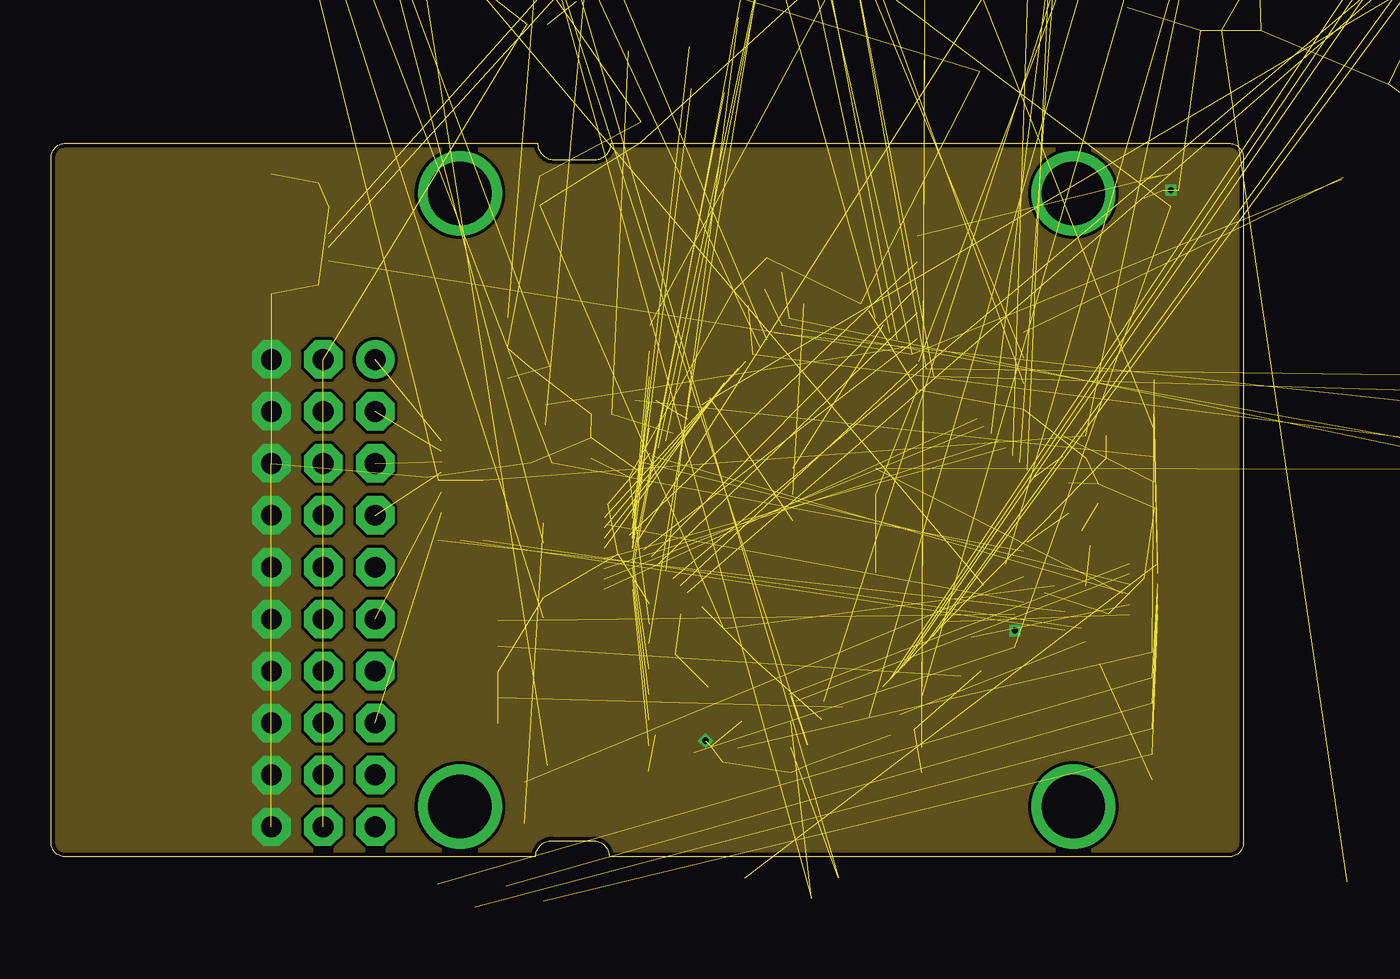
[diagram p13: board, inner layer Ground]
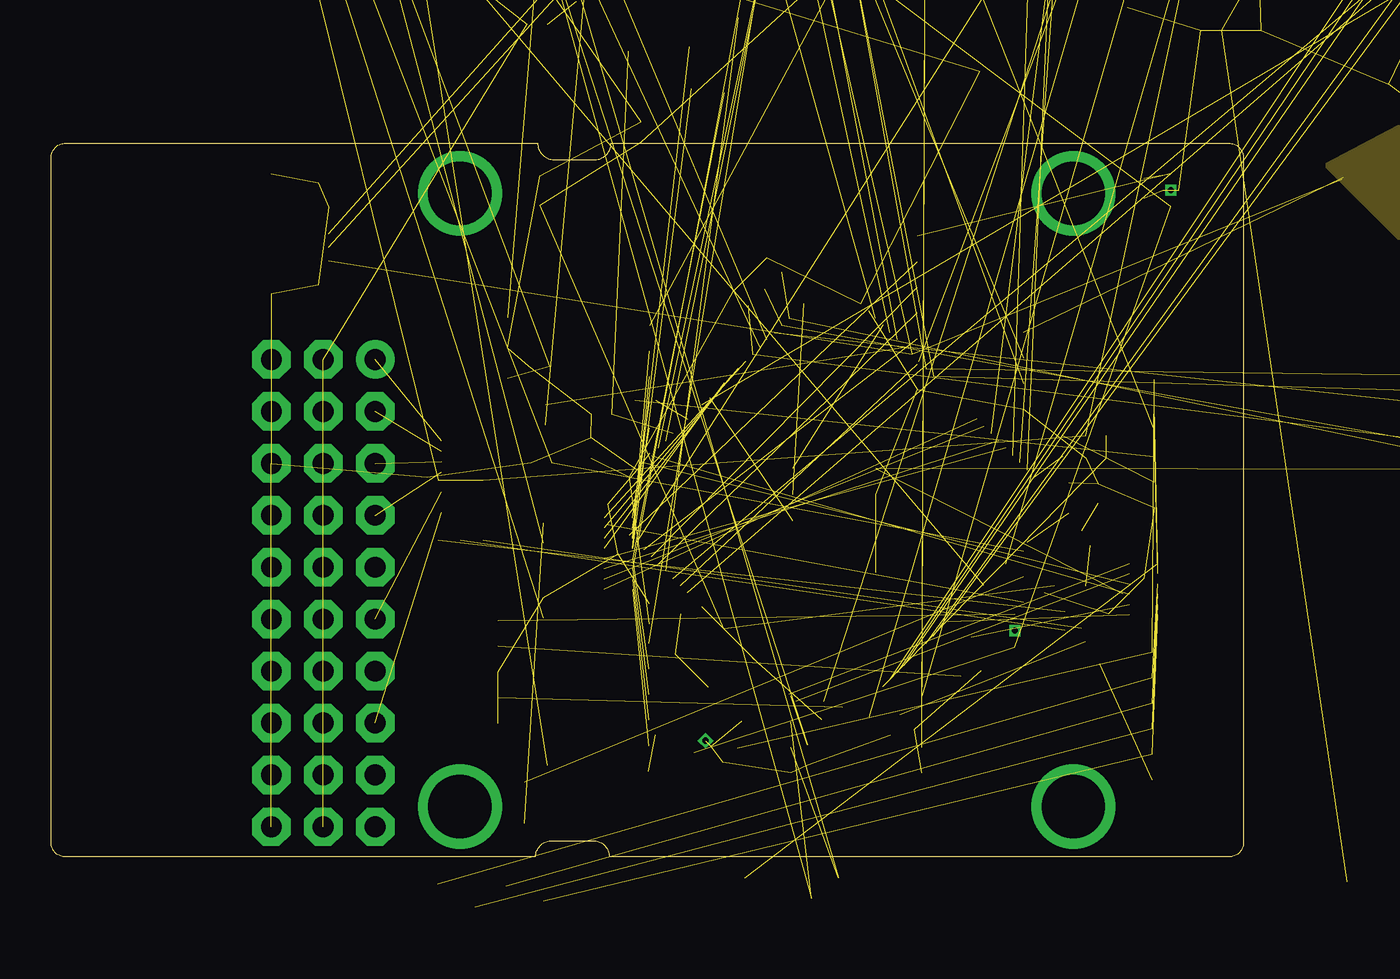
[diagram p14: board, inner layer Vertical]
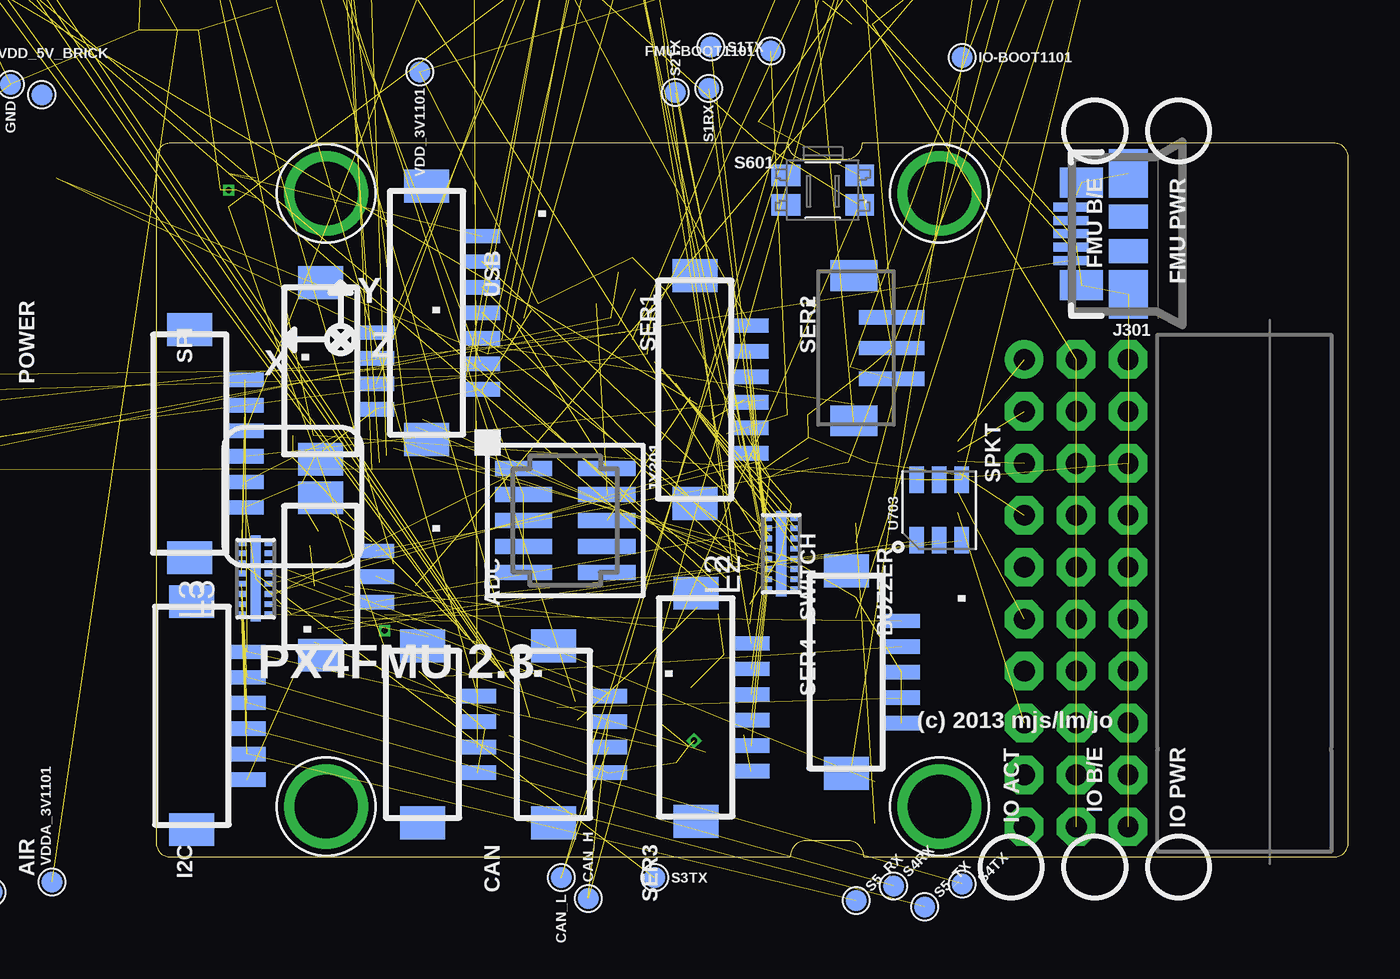
[diagram p15: board, bottom side, seen from below]

Size 58.32 x 34.91 mm. Coordinates in mm from the lower left corner, seen from the top.
Outline: 23.7,0 0.7,0 arc-90 0,0.7 0,34.21 arc-90 0.7,34.91 23.8,34.91 arc90 24.59,34.11 26.59,34.11 arc90 27.39,34.91 57.62,34.91 arc-90 58.32,34.21 58.32,0.7 arc-90 57.62,0 27.3,0 arc90 26.5,0.8 24.5,0.8 arc90 23.7,0
Copper layers (1*2*3*14*15*16): Top 0.035mm / dielectric 0.5mm / Ground 0.035mm / dielectric 0.15mm / Horizontal 0.035mm / dielectric 0.15mm / Vertical 0.035mm / dielectric 0.15mm / Power 0.035mm / dielectric 0.5mm / Bottom 0.035mm
Design rules "default *": minimum track width 0.15mm, minimum drill 0.2mm, track to track 0.15mm, track to pad 0.15mm, pad to pad 0.15mm, via to via 0.15mm, smd to smd 0.15mm, copper to edge 0.2mm, drill to drill 0.2mm, minimum pad ring 0.125mm, minimum via ring 0.125mm, stop-mask expansion 1mil, vias tented up to drill 0.31mm, thermal gap 8mil

### Footprints (pad centres in the part's own frame; a part is rotated, then mirrored left to right if it is on the bottom)
PAD.04X.04 = smd 1.016 x 1.016: P$1 0,0
0402-CAP = smd 0.5 x 0.6: P$1 -0.5,0; P$2 0.5,0
0805-CAP = smd 0.7 x 1.3: P$1 -0.95,0; P$2 0.95,0
0603-CAP = smd 0.6 x 0.9: P$1 -0.75,0; P$2 0.75,0
MICROSMP = smd 0.8 x 0.8: ANODE 0.65,0 | smd 2 x 1.1: CATHODE -1.25,0
3X10RA = drill 1.016 pad 1.88: 1 2.54,19.05 | drill 1.016 pad 1.88 octagon: 2 0,19.05; 3 -2.54,19.05; 4 2.54,16.51; 5 0,16.51; 6 -2.54,16.51; 7 2.54,13.97; 8 0,13.97; 9 -2.54,13.97; 10 2.54,11.43; 11 0,11.43; 12 -2.54,11.43; 13 2.54,8.89; 14 0,8.89; 15 -2.54,8.89; 16 2.54,6.35; 17 0,6.35; 18 -2.54,6.35; 19 2.54,3.81; 20 0,3.81; 21 -2.54,3.81; 22 2.54,1.27; 23 0,1.27; 24 -2.54,1.27; 25 2.54,-1.27; 26 0,-1.27; 27 -2.54,-1.27; 28 2.54,-3.81; 29 0,-3.81; 30 -2.54,-3.81
DF13C-6P-1.25V = smd 1.6 x 2.2: M$0 5.575,-1.8; M$1 -5.575,-1.8 | smd 0.7 x 1.8: P$1 -3.125,0.9; P$2 -1.875,0.9; P$3 -0.625,0.9; P$4 0.625,0.9; P$5 1.875,0.9; P$6 3.125,0.9
MOLEX-47346-0001 = smd 1.7 x 0.44: D+ 2.8,0; D- 2.8,0.65; GND 2.8,-1.3; ID 2.8,-0.65; VBUS 2.8,1.3 | smd 1.9 x 2.375: GND1 0,2.95; GND4 0,-2.95 | smd 2.1 x 1.475: GND2 2.3,2.5; GND3 2.3,-2.5 | smd 1.9 x 1.175: GND5 0,-0.838; GND6 0,0.838
DF13C-4P-1.25V = smd 1.6 x 2.2: M$0 4.325,-1.8; M$1 -4.325,-1.8 | smd 0.7 x 1.8: P$1 -1.875,0.9; P$2 -0.625,0.9; P$3 0.625,0.9; P$4 1.875,0.9
DF13C-7P-1.25V = smd 1.6 x 2.2: M$0 6.2,-1.8; M$1 -6.2,-1.8 | smd 0.7 x 1.8: P$1 -3.75,0.9; P$2 -2.5,0.9; P$3 -1.25,0.9; P$4 0,0.9; P$5 1.25,0.9; P$6 2.5,0.9; P$7 3.75,0.9
DF13C-5P-1.25V = smd 1.6 x 2.2: M$0 4.95,-1.8; M$1 -4.95,-1.8 | smd 0.7 x 1.8: P$1 -2.5,0.9; P$2 -1.25,0.9; P$3 0,0.9; P$4 1.25,0.9; P$5 2.5,0.9
DF13C-3P-1.25V = smd 1.6 x 2.2: M$0 3.85,-1.8; M$1 -3.85,-1.8 | smd 0.7 x 1.8: P$1 -1.25,0.9; P$2 0,0.9; P$3 1.25,0.9
JST-ZH-SMT-VERTICAL = smd 0.7 x 3.2: P$1 -1.5,-1.75; P$2 0,-1.75; P$3 1.5,-1.75 | smd 1.5 x 2.3: P$4 3.55,0.1; P$5 -3.55,0.1
FIDUCIAL-1.5X3 = smd 1.5 x 1.5: 1 0,0
FTSH-105-01-XXX-DV-K = smd 0.737 x 2.794: 1 -2.54,-2.032; 2 -2.54,2.032; 3 -1.27,-2.032; 4 -1.27,2.032; 5 0,-2.032; 6 0,2.032; 7 1.27,-2.032; 8 1.27,2.032; 9 2.54,-2.032; 10 2.54,2.032
HEADER_3X01_SMD_H_BOARD_EDGE_SHORT = smd 1.27 x 1.778: 1 -2.54,0; 2 0,0; 3 2.54,0
DFN16-THIN = smd 0.28 x 0.51: P$1 -1.75,-0.7; P$2 -1.25,-0.7; P$3 -0.75,-0.7; P$4 -0.25,-0.7; P$5 0.25,-0.7; P$6 0.75,-0.7; P$7 1.25,-0.7; P$8 1.75,-0.7; P$9 1.75,0.7; P$10 1.25,0.7; P$11 0.75,0.7; P$12 0.25,0.7; P$13 -0.25,0.7; P$14 -0.75,0.7; P$15 -1.25,0.7; P$16 -1.75,0.7 | smd 4.2 x 0.5: P$EP 0,0
KYOCERA-KNH16-DA = smd 0.6 x 0.6: P$1 -0.8,0; P$2 0.8,0 | smd 0.4 x 0.4: P$3 0,-0.4; P$4 0,0.4 | drill 0.3 pad 0.4 square: P$5 0,0
0603-LED = smd 0.6 x 0.9: A 0.75,0; C -0.75,0
MOUNT-HOLE3.1 = drill 3.1 pad 4.1: P$1 0,0
0402-RES = smd 0.5 x 0.6: P$1 -0.5,0; P$2 0.5,0
EVQP7J01K = smd 1.4 x 1.05: A1 -1.8,0.725; A2 1.8,0.725; B3 -1.8,-0.725; B4 1.8,-0.725
QFN-24-TESTING = smd 1.016 x 0.254: 1 -2.066,1.257; 2 -2.066,0.75; 3 -2.066,0.247; 4 -2.066,-0.287; 5 -2.066,-0.792; 6 -2.066,-1.297; 13 2.086,-1.297; 14 2.086,-0.792; 15 2.086,-0.287; 16 2.086,0.247; 17 2.086,0.75; 18 2.086,1.257 | smd 0.254 x 1.016: 7 -1.267,-2.122; 8 -0.762,-2.122; 9 -0.258,-2.122; 10 0.278,-2.122; 11 0.78,-2.122; 12 1.287,-2.122; 19 1.287,2.082; 20 0.78,2.082; 21 0.278,2.082; 22 -0.258,2.082; 23 -0.762,2.082; 24 -1.267,2.082 | smd 2.616 x 2.616: P$1 0.02,-0.01
TQFP100 = smd 1.5 x 0.29: 1 -8,6; 2 -8,5.5; 3 -8,5; 4 -8,4.5; 5 -8,4; 6 -8,3.5; 7 -8,3; 8 -8,2.5; 9 -8,2; 10 -8,1.5; 11 -8,1; 12 -8,0.5; 13 -8,0; 14 -8,-0.5; 15 -8,-1; 16 -8,-1.5; 17 -8,-2; 18 -8,-2.5; 19 -8,-3; 20 -8,-3.5; 21 -8,-4; 22 -8,-4.5; 23 -8,-5; 24 -8,-5.5; 25 -8,-6; 51 8,-6; 52 8,-5.5; 53 8,-5; 54 8,-4.5; 55 8,-4; 56 8,-3.5; 57 8,-3; 58 8,-2.5; 59 8,-2; 60 8,-1.5; 61 8,-1; 62 8,-0.5; 63 8,0; 64 8,0.5; 65 8,1; 66 8,1.5; 67 8,2; 68 8,2.5; 69 8,3; 70 8,3.5; 71 8,4; 72 8,4.5; 73 8,5; 74 8,5.5; 75 8,6 | smd 0.29 x 1.5: 26 -6,-8; 27 -5.5,-8; 28 -5,-8; 29 -4.5,-8; 30 -4,-8; 31 -3.5,-8; 32 -3,-8; 33 -2.5,-8; 34 -2,-8; 35 -1.5,-8; 36 -1,-8; 37 -0.5,-8; 38 0,-8; 39 0.5,-8; 40 1,-8; 41 1.5,-8; 42 2,-8; 43 2.5,-8; 44 3,-8; 45 3.5,-8; 46 4,-8; 47 4.5,-8; 48 5,-8; 49 5.5,-8; 50 6,-8; 76 6,8; 77 5.5,8; 78 5,8; 79 4.5,8; 80 4,8; 81 3.5,8; 82 3,8; 83 2.5,8; 84 2,8; 85 1.5,8; 86 1,8; 87 0.5,8; 88 0,8; 89 -0.5,8; 90 -1,8; 91 -1.5,8; 92 -2,8; 93 -2.5,8; 94 -3,8; 95 -3.5,8; 96 -4,8; 97 -4.5,8; 98 -5,8; 99 -5.5,8; 100 -6,8
SO08 = smd 0.61 x 2.21: 1 -1.905,-2.616; 2 -0.635,-2.616; 3 0.635,-2.616; 4 1.905,-2.616; 5 1.905,2.616; 6 0.635,2.616; 7 -0.635,2.616; 8 -1.905,2.616
MICROSD = smd 0.8 x 1.5: 1 -1.94,2.7; 2 -0.84,2.3; 3 0.26,2.7; 4 1.36,2.9; 5 2.46,2.7; 6 3.56,2.9; 7 4.66,2.7; 8 5.76,2.7 | smd 1.4 x 1.9: NC -6.85,6.55; NC3 6.55,5.55 | smd 1.8 x 1.4: NC1 -0.75,-7.6; NC2 4.95,-7.6
SOT23-8 = smd 0.42 x 1.3: 1 -0.975,-1.175; 2 -0.325,-1.175; 3 0.325,-1.175; 4 0.975,-1.175; 5 0.975,1.175; 6 0.325,1.175; 7 -0.325,1.175; 8 -0.975,1.175
SON10 = smd 0.32 x 0.5: 1 -1,-1.375; 2 -0.5,-1.375; 3 0,-1.375; 4 0.5,-1.375; 5 1,-1.375; 6 1,1.375; 7 0.5,1.375; 8 0,1.375; 9 -0.5,1.375; 10 -1,1.375
6-PLCC = smd 1.3 x 0.7: A1 1.475,1.1; A2 1.475,0; A3 1.475,-1.1; C1 -1.475,1.1; C2 -1.475,0; C3 -1.475,-1.1
TSSOP8_SOT505-2 = smd 0.35 x 0.85: 1 -0.975,-1.775; 2 -0.325,-1.775; 3 0.325,-1.775; 4 0.975,-1.775; 5 0.975,1.775; 6 0.325,1.775; 7 -0.325,1.775; 8 -0.975,1.775
51281-1094 = smd 0.34 x 0.8: 1 0,0; 2 0.5,0; 3 1,0; 4 1.5,0; 5 2,0; 6 2.5,0; 7 3,0; 8 3.5,0; 9 4,0; 10 4.5,0 | smd 0.6 x 2.6: P$11 -0.9,-2.3; P$12 5.4,-2.3
0402-TVS = smd 0.5 x 0.6: A 0.5,0; C -0.5,0
SOT563-6 = smd 0.3 x 0.45: 1 -0.5,-0.675; 2 0,-0.675; 3 0.5,-0.675; 4 0.5,0.675; 5 0,0.675; 6 -0.5,0.675
QFN8-DSG = smd 0.28 x 0.5: 1 -0.75,-0.95; 2 -0.25,-0.95; 3 0.25,-0.95; 4 0.75,-0.95; 5 0.75,0.95; 6 0.25,0.95; 7 -0.25,0.95; 8 -0.75,0.95 | smd 1.6 x 0.9: GND 0,0 | drill 0.3 square: P$2 -0.4,0; P$3 0.4,0
MLF-8-EPAD = smd 0.5 x 0.3: 1 -0.8,0.75; 2 -0.8,0.25; 3 -0.8,-0.25; 4 -0.8,-0.75; 5 0.8,-0.75; 6 0.8,-0.25; 7 0.8,0.25; 8 0.8,0.75 | smd 0.7 x 1.4: GND 0,0
OSCILLATOR-3.2X2.5 = smd 1.4 x 1.2: 1 -1.1,-0.85; 2 1.1,-0.85; 3 1.1,0.85; 4 -1.1,0.85

### Placement (x,y rotation side)
ADC_PR  66.34,-1.73 270 bottom  (outside the outline)
C101  41.86,6.6 315 top
C102  30.89,10.26 225 top
C103  32.51,8.64 45 top
C402  20.02,57.2 180 top  (outside the outline)
C503  67.77,50.8 0 top  (outside the outline)
C505  67.77,49.58 0 top  (outside the outline)
C506  58.22,40.44 0 top  (outside the outline)
C507  58.62,41.96 0 top  (outside the outline)
C508  67.46,56.18 0 top  (outside the outline)
C509  55.27,40.44 0 top  (outside the outline)
C510  58.62,43.08 0 top  (outside the outline)
C601  53.64,59.03 0 top  (outside the outline)
C602  55.07,54.76 90 top  (outside the outline)
C603  57.4,56.69 0 top  (outside the outline)
C604  57.2,54.86 0 top  (outside the outline)
C605  57.4,58.22 0 top  (outside the outline)
C606  32.41,54.66 45 top  (outside the outline)
C607  51.21,17.78 90 top
C608  26.42,20.02 90 top
C609  28.85,35.46 270 top
C610  29.26,11.89 90 top
C611  49.78,17.58 90 top
C612  34.14,7.01 225 top
C613  33.43,53.44 45 top  (outside the outline)
C701  51.71,12.4 270 top
C901  11.48,55.07 0 top  (outside the outline)
C1001  14.22,58.32 0 top  (outside the outline)
C1002  12.29,62.08 90 top  (outside the outline)
C1003  9.35,60.15 270 top  (outside the outline)
C1004  10.87,62.08 90 top  (outside the outline)
CAN_H  37.19,-2.03 90 bottom
CAN_L  38.51,-1.02 270 bottom
D1  22.15,42.16 180 top  (outside the outline)
FMU-BOOT1101  28.24,39.42 0 bottom  (outside the outline)
GND  65.43,37.8 270 bottom  (outside the outline)
GND.  31.09,57.61 0 bottom  (outside the outline)
IO-BOOT1101  18.9,39.12 0 bottom  (outside the outline)
J1  13.31,5.28 0 top
J201  30.17,22.87 270 bottom
J202  30.12,7.32 270 bottom
J203  54.86,20.22 270 bottom
J204  54.76,6.91 270 bottom
J301  10.77,30.48 180 bottom
J302  48.46,23.77 270 bottom
J401  43.48,5.99 270 bottom
J403  43.28,26.62 270 bottom
J404  22.76,9.04 270 bottom
J405  37.08,5.99 270 bottom
J702  48.46,13.72 270 bottom
J801  24.08,24.89 90 bottom
JP1  50.39,36.88 0 top
JP2  28.96,74.98 0 top  (outside the outline)
JX301  38.3,16.46 270 bottom
JX801  24.38,51.41 0 bottom  (outside the outline)
L1  18.39,18.59 270 top
L2  27.74,14.83 90 bottom
L3  53.44,13.61 90 bottom
L201  43.28,53.14 180 top  (outside the outline)
L202  34.54,47.65 0 top  (outside the outline)
L203  32,5.69 45 top
L402  54.76,32.61 90 top
L403  17.98,63.3 90 top  (outside the outline)
L404  47.14,11.07 90 top
L601  61.26,70.41 180 top  (outside the outline)
L602  61.26,71.93 180 top  (outside the outline)
L603  59.54,66.04 180 top  (outside the outline)
L901  23.27,44.6 0 top  (outside the outline)
LED701  11.48,49.38 270 bottom  (outside the outline)
LED702  6.2,68.48 90 bottom  (outside the outline)
LED703  10.26,68.48 90 bottom  (outside the outline)
LED704  7.72,49.28 270 bottom  (outside the outline)
LED705  14.33,68.48 90 bottom  (outside the outline)
M3_MOUNT1101  20,32.46 0 top
M3_MOUNT1102  50,2.46 0 top
M3_MOUNT1103  50,32.46 0 top
M3_MOUNT1104  20,2.46 0 top
OSHW_LOGO  60.59,33.02 0 top
R3  14.73,46.74 180 top  (outside the outline)
R4  24.08,15.85 270 top
R12  29.06,22.35 180 top
R13  49.48,20.12 90 top
R101  24.18,21.64 270 top
R102  45.11,9.45 315 top
R301  35.36,28.96 135 top
R302  34.54,28.14 135 top
R303  33.73,27.33 135 top
R304  37.9,52.73 45 top  (outside the outline)
R305  37.8,54.05 45 top  (outside the outline)
R306  49.58,14.73 90 top
R307  50.8,14.73 90 top
R401  39.62,69.8 180 top  (outside the outline)
R402  39.62,68.68 180 top  (outside the outline)
R404  42.37,71.42 0 top  (outside the outline)
R405  42.37,70.31 0 top  (outside the outline)
R407  43.89,8.23 315 top
R408  38.2,6.71 0 top
R409  19.81,62.99 0 top  (outside the outline)
R603  53.95,54.76 270 top  (outside the outline)
R604  59.03,70.41 0 top  (outside the outline)
R605  59.03,71.83 0 top  (outside the outline)
R606  59.03,68.17 180 top  (outside the outline)
R607  59.03,69.29 180 top  (outside the outline)
R608  33.63,41.55 90 top  (outside the outline)
R609  51.1,20.62 180 top
R610  51.1,19.51 180 top
R611  26.92,21.64 0 top
R704  50.8,9.45 180 top
R707  16.76,46.74 180 top  (outside the outline)
R708  24.08,12.19 270 top
R709  23.16,2.13 270 top
R710  23.16,4.17 90 top
R711  8.64,46.74 180 top  (outside the outline)
R712  24.28,4.98 270 top
R713  27.23,16.76 90 top
R901  14.43,60.05 270 top  (outside the outline)
R909  7.01,55.07 180 top  (outside the outline)
R910  7.01,56.18 180 top  (outside the outline)
R918  25.7,42.37 270 top  (outside the outline)
R919  25.7,44.4 270 top  (outside the outline)
R922  23.77,40.74 180 top  (outside the outline)
R1002  13.31,60.05 90 top  (outside the outline)
S1RX  31.29,37.59 270 bottom
S1TX  31.19,39.62 0 bottom  (outside the outline)
S2RX  34.54,46.43 270 bottom  (outside the outline)
S2TX  32.92,37.39 90 bottom
S3RX  31.6,77.22 270 bottom  (outside the outline)
S3TX  33.93,-1.02 0 bottom
S4RX  22.25,-1.42 45 bottom
S4TX  18.9,-1.32 45 bottom
S5_RX  24.08,-2.13 45 bottom
S5_TX  20.73,-2.44 45 bottom
S601  25.7,32.61 180 bottom
U1  54.76,6.3 0 top
U101  38.2,17.17 45 top
U102  50.5,69.6 180 top  (outside the outline)
U301  84.63,17.58 90 bottom  (outside the outline)
U401  19.91,60.15 0 top  (outside the outline)
U701  49.58,11.89 180 top
U703  20.02,16.97 90 bottom
U903  9.45,52.73 270 top  (outside the outline)
U$1  68.48,43.18 180 top  (outside the outline)
U$6  23.16,43.48 0 top  (outside the outline)
U$201  43.38,51.31 0 top  (outside the outline)
U$202  34.95,46.43 180 top  (outside the outline)
U$203  33.22,4.98 225 top
U$301  35.56,53.95 180 top  (outside the outline)
U$401  52.63,42.06 270 top  (outside the outline)
U$402  53.44,32.72 270 top
U$403  45.92,11.07 270 top
U$404  36.98,4.98 270 top
U$604  61.67,68.48 90 top  (outside the outline)
U$605  53.64,57.1 0 top  (outside the outline)
U$701  23.98,19.3 180 top
U$801  23.88,23.98 180 top
U$901  9.04,55.07 0 top  (outside the outline)
U$902  9.04,56.18 0 top  (outside the outline)
U$1002  11.48,59.54 90 top  (outside the outline)
VDD_3V1101  45.42,38.4 0 bottom  (outside the outline)
VDD_5V_BRICK  63.91,37.29 270 bottom  (outside the outline)
VDDA_3V1101  63.4,-1.22 0 bottom  (outside the outline)
X101  29.29,7.43 135 top

### Tracks (layer width: path | path; a pad name or v marks a point on that pad's centre or on a via)
!ACCEL_MAG_CS  (1 unrouted)
!FMU-LED_AMBER  (1 unrouted)
!FRAM_CS  (1 unrouted)
!GYRO_CS  (1 unrouted)
!SPI_EXT_NSS  (1 unrouted)
!VDD_5V_PERIPH_EN  (2 unrouted)
!VDD_5V_PERIPH_OC  (1 unrouted)
ACCEL_DRDY  (1 unrouted)
BATT_CURRENT_SENS  (1 unrouted)
  Top 0.152: 40.03,6.86 40.03,6.3
BATT_VOLTAGE_SENS  (1 unrouted)
  Top 0.152: 37.14,7.62 37.8,7.62
CAN1_RX  (1 unrouted)
CAN1_TX  (1 unrouted)
CAN2_RX  (1 unrouted)
CAN2_TX  (1 unrouted)
CAN_H  (3 unrouted)
CAN_L  (3 unrouted)
FMU-!RESET  (4 unrouted)
FMU-BOOT0  (2 unrouted)
FMU-CH1-PROT  (1 unrouted)
FMU-I2C1_SCL  (2 unrouted)
FMU-I2C1_SDA  (2 unrouted)
FMU-I2C2_SCL
  Top 0.152: U701.3 R306.P$1 49.49,14.23 49.17,13.92 47.82,13.92 U101.47
FMU-I2C2_SDA
  Top 0.152: U701.2 50.08,13.51 R307.P$1 50.69,14.23 50.19,14.73 48.87,14.73 48.56,14.43 48.02,14.43 U101.48
FMU-SWCLK  (1 unrouted)
FMU-SWDIO  (1 unrouted)
FMU-SWO  (1 unrouted)
FMU-UART4_RX  (1 unrouted)
  Top 0.152: U101.24 35.66,6.85 35.66,5.99 36.27,5.38
FMU-UART4_TX  (1 unrouted)
  Top 0.152: U101.23 35.36,7.25 35.36,5.79
FMU-UART7_RX  (1 unrouted)
FMU-UART7_TX  (1 unrouted)
  Top 0.152: 45.01,10.77 45.01,11.07 U101.39
FMU-UART8_RX  (1 unrouted)
FMU-UART8_TX  (1 unrouted)
FMU-USART2_CTS  (1 unrouted)
FMU-USART2_RTS  (1 unrouted)
FMU-USART2_RX  (1 unrouted)
FMU-USART2_TX  (1 unrouted)
FMU-USART3_CTS  (1 unrouted)
FMU-USART3_RTS  (1 unrouted)
FMU-USART3_RX  (1 unrouted)
FMU-USART3_TX  (1 unrouted)
FMU-VDD_3V3  (27 unrouted)
  Top 0.254: U101.11 30.69,11.07 29.57,11.07 C610.P$1 | U101.22 34.76,7.36 C612.P$1 34.65,7.21 | C101.P$1 41.34,6.96 U101.28 39.46,8.84 36.92,8.84 36.58,9.18 36.51,9.11 | U101.50 48.3,15.95 49.58,15.95 | 49.58,15.95 50.39,15.95 50.8,15.54 R307.P$2 | 48.36,16.02 U101.50 | 48.15,15.76 U101.50 | R306.P$2 49.58,15.95 | U101.22 36.51,9.11 | U101.21 U101.22 | U101.19 35.53,10.26 36.51,9.29 36.51,9.11 | U701.10 51,10.93 51,12.9 | 51,12.9 50.64,13.26 U701.1 | 51,12.9 C701.P$1 52.42,12.89 52.43,12.9
FMU-VDD_5V  (5 unrouted)
FMU-VDD_5V5  (4 unrouted)
FMU_AUX_ADC1  (1 unrouted)
  Top 0.152: R408.P$1 37.7,6.21 37.59,6.1
FMU_AUX_ADC1_PROT  (1 unrouted)
  Top 0.152: R408.P$2 38.7,7.32 38.61,7.42
FMU_AUX_ADC2
  Top 0.152: U101.33 43.25,8.58 R407.P$1
FMU_AUX_ADC2_PROT  (1 unrouted)
  Top 0.152: 44.3,7.82 R407.P$2 44.5,8.13 44.5,8.84
FRAM_MISO  (1 unrouted)
FRAM_MOSI  (1 unrouted)
FRAM_SCK  (1 unrouted)
GNDX  (130 unrouted)
  Top 0.254: U101.10 30.8,11.89 30.07,11.89 29.57,12.39 C610.P$2 | C102.P$2 30.21,9.91 X101.2 28.38,9.55 | U101.20 34.17,8.19 | 34.17,8.19 33.78,7.8 C612.P$2 | 34.17,8.19 33.77,8.19 33.73,8.23 32.21,8.23 C103.P$1 | U101.27 41.34,6.25 | 41.34,6.25 C101.P$2 | R704.P$1 51.61,9.76 51.61,10.67 51.71,10.77 C701.P$2 | 41.05,5.95 41.34,6.25 | R102.P$2 45.92,9.55 U$403.A 46.24,10.57 L404.P$4 L404.P$5 L404.P$3 48.16,11.69 48.16,12.5 48.58,12.92 U701.5 | X101.4 29.55,5.97 L203.P$4 | L203.P$4 | L203.P$4 L203.P$5
  pour Ground (no thermals): 69.9,37.8 0,37.8 0,-2.72 arc90 0.02,-2.74 62.18,-2.74 69.9,-2.74
GPIO_EXT_1  (1 unrouted)
GYRO_DRDY  (1 unrouted)
IO-USART1_RX  (1 unrouted)
IO-USART1_TX  (1 unrouted)
IO-VDD_3V3  (5 unrouted)
MAG_DRDY  (1 unrouted)
  Top 0.152: U101.36 44.09,9.86 44.09,9.35
N$1
  Top 0.152: U101.13 31.9,10.87 31.9,9.95 32.26,9.6 | 32.26,9.6 C103.P$2 | X101.1 30.67,8.01 32.26,9.6
N$2
  Top 0.152: U101.12 31.24,10.92 C102.P$1 31.24,9.4 29.46,7.62 27.92,7.62 X101.3
N$3  (1 unrouted)
N$5  (2 unrouted)
N$7  (1 unrouted)
N$8  (1 unrouted)
N$9  (1 unrouted)
N$11  (1 unrouted)
N$12  (1 unrouted)
N$13  (1 unrouted)
N$14  (1 unrouted)
N$15  (1 unrouted)
N$19  (1 unrouted)
N$23  (1 unrouted)
N$26  (1 unrouted)
N$29  (1 unrouted)
N$33  (1 unrouted)
N$34  (1 unrouted)
N$36  (1 unrouted)
N$37  (1 unrouted)
N$38  (3 unrouted)
N$39  (1 unrouted)
N$40  (1 unrouted)
N$41  (2 unrouted)
N$42  (1 unrouted)
N$48  (2 unrouted)
N$57  (1 unrouted)
N$77  (1 unrouted)
N$78  (1 unrouted)
N$79  (1 unrouted)
N$95
  Top 0.152: R704.P$2 49.17,9.45 48.77,9.85 48.58,10.04 U701.6
N$98  (1 unrouted)
  Top 0.254: U$403.C 46.22,11.87 L404.P$2
N$100  (2 unrouted)
  Top 0.254: U$203.C 33.49,5.33 L203.P$2 32.51,6.31 32.51,7.21
N$101  (2 unrouted)
N$102  (1 unrouted)
N$103  (1 unrouted)
N$104  (1 unrouted)
N$110  (2 unrouted)
OTG_DM1  (2 unrouted)
OTG_DP1  (2 unrouted)
OTG_FS_DM  (1 unrouted)
OTG_FS_DP  (1 unrouted)
PB2-BOOT1
  Top 0.152: U101.37 44.76,9.91 R102.P$1
PPM_INPUT  (2 unrouted)
RGB_LED_3  (1 unrouted)
  Top 0.152: U701.9 50.08,10.86 50.39,11.18
RGB_LED_4  (1 unrouted)
  Top 0.152: U701.8 49.58,11.07
RGB_LED_14  (1 unrouted)
  Top 0.152: U701.7 49.08,11.49 49.58,11.99
SAFETY  (1 unrouted)
SDIO_CK  (1 unrouted)
SDIO_CMD  (2 unrouted)
SDIO_D0  (2 unrouted)
SDIO_D1  (2 unrouted)
SDIO_D2  (2 unrouted)
SDIO_D3  (2 unrouted)
SERIAL1_CTS  (1 unrouted)
SERIAL1_RTS  (1 unrouted)
SERIAL1_RX  (2 unrouted)
SERIAL1_TX  (2 unrouted)
SERIAL2_CTS  (1 unrouted)
SERIAL2_RTS  (1 unrouted)
SERIAL2_RX  (2 unrouted)
SERIAL2_TX  (2 unrouted)
SERIAL3_RX  (2 unrouted)
SERIAL3_TX  (2 unrouted)
SERIAL4_RX  (2 unrouted)
SERIAL4_TX  (2 unrouted)
SERIAL5_RX  (2 unrouted)
SERIAL5_TX  (2 unrouted)
SPI_EXT_MISO  (1 unrouted)
SPI_EXT_MOSI  (1 unrouted)
SPI_EXT_SCK  (1 unrouted)
SPI_INT_MISO  (1 unrouted)
  Top 0.152: 42.27,8.13 42.27,8.16 U101.31
SPI_INT_MOSI  (1 unrouted)
  Top 0.152: 42.88,7.72 42.88,8.25 U101.32
SPI_INT_SCK  (1 unrouted)
  Top 0.152: U101.30 42.47,7.25 42.47,7.21
VBAT  (1 unrouted)
VBUS  (4 unrouted)
  Top 0.254: 63.2,33.22 63.12,33.15
VDD_3V3_SENSORS  (7 unrouted)
VDD_3V3_SENSORS_EN  (2 unrouted)
VDD_3V3_SPEKTRUM  (3 unrouted)
VDD_3V3_SPEKTRUM_EN  (1 unrouted)
VDD_5V_IN  (7 unrouted)
VDD_5V_PERIPH  (5 unrouted)
VDD_5V_SENS  (2 unrouted)
VDD_SERVO  (11 unrouted)
  pour Vertical (no thermals): 69.9,37.8 69.9,29.87 66.34,29.87 62.38,33.83
VDD_SERVO_SENS  (1 unrouted)

### Text on the board
tPlace: PX4FMULite V0.1
bPlace: FMU PWR | FMU B/E | USB | SER2 | SER1 | Y | POWER | SPI | Z | X | SPKT | SWITCH | BUZZER | ADC | SER4 | PX4FMU 2.3 | (c) 2013 mjs/lm/jo | IO PWR | IO B/E | IO ACT | AIR | SER3 | CAN | I2C
Document: Optimized for good / manual soldering / accessibility